# EAGLE board design_main (EAGLE 9.6.2), part 1 of 2
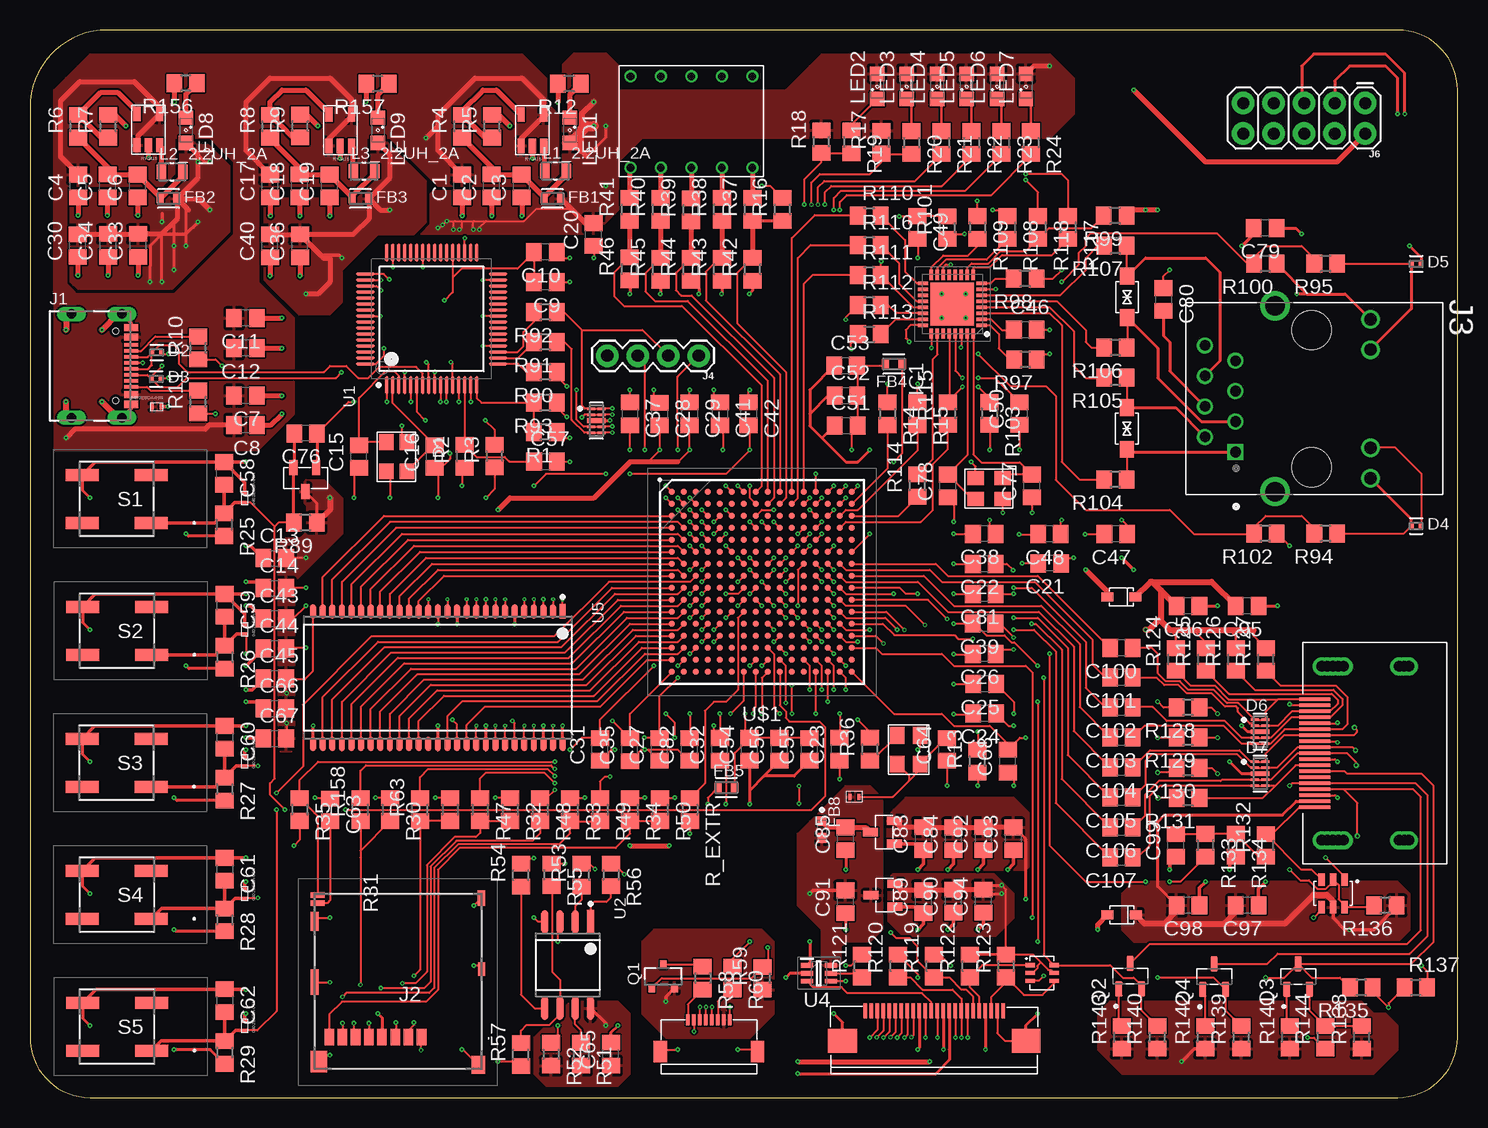
[diagram p4: board, top side]
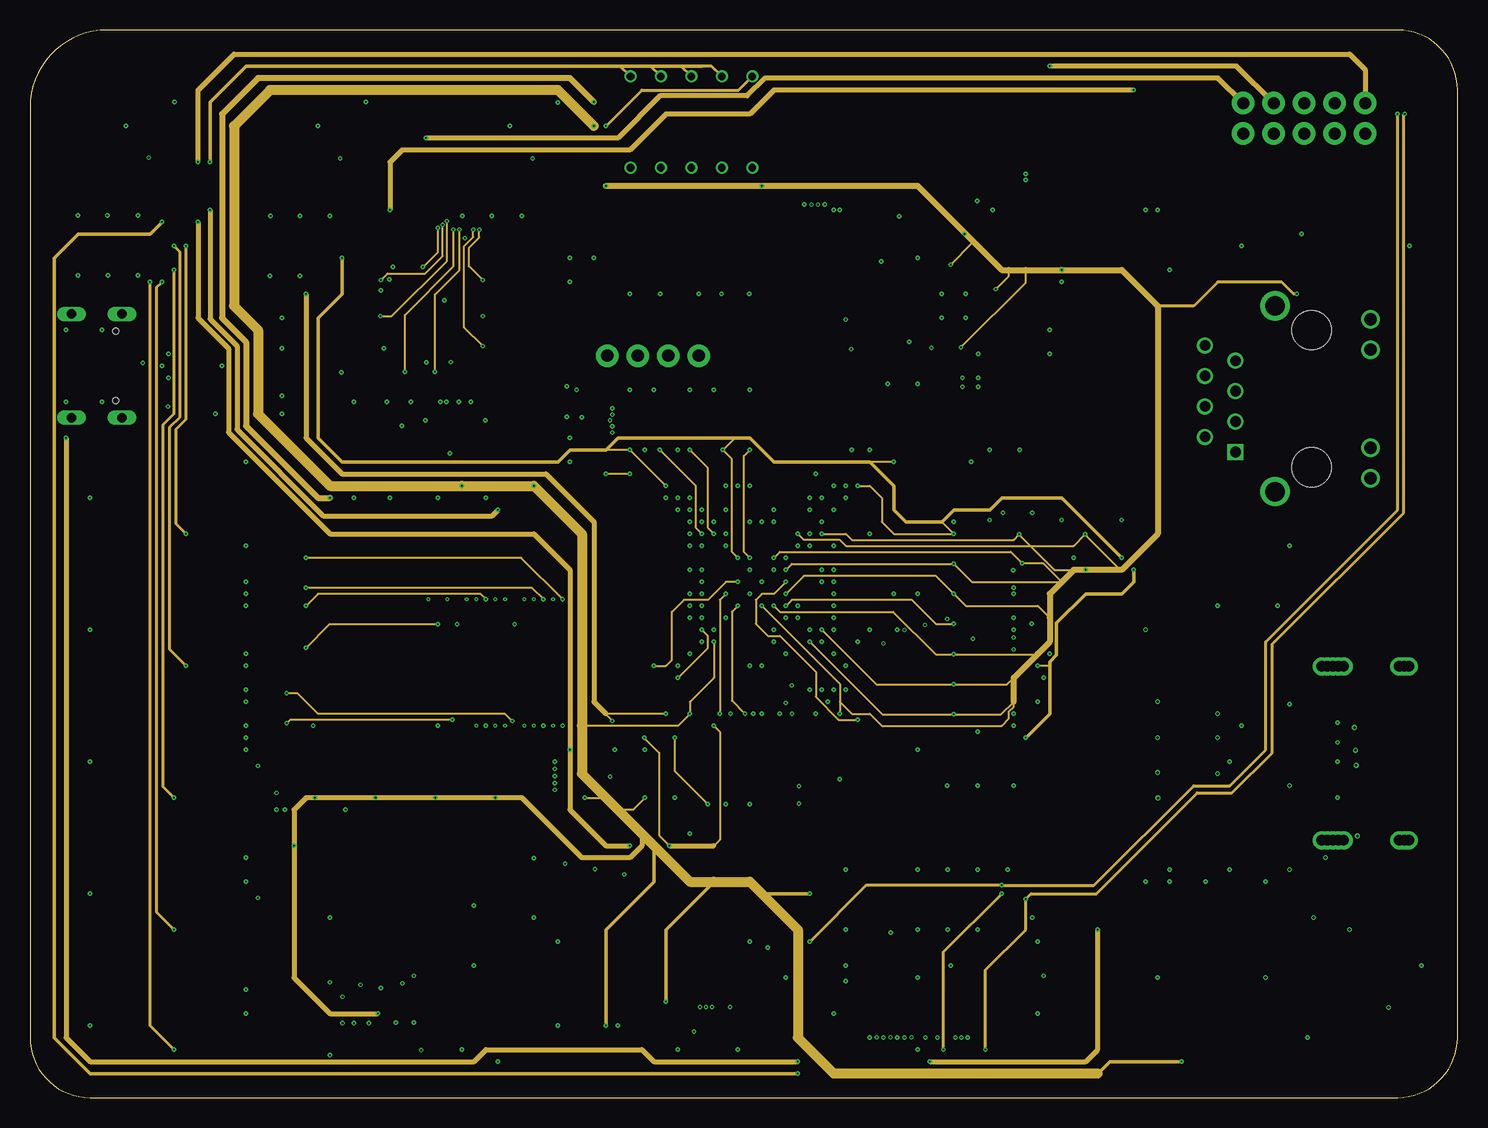
[diagram p5: board, inner layer Route2]
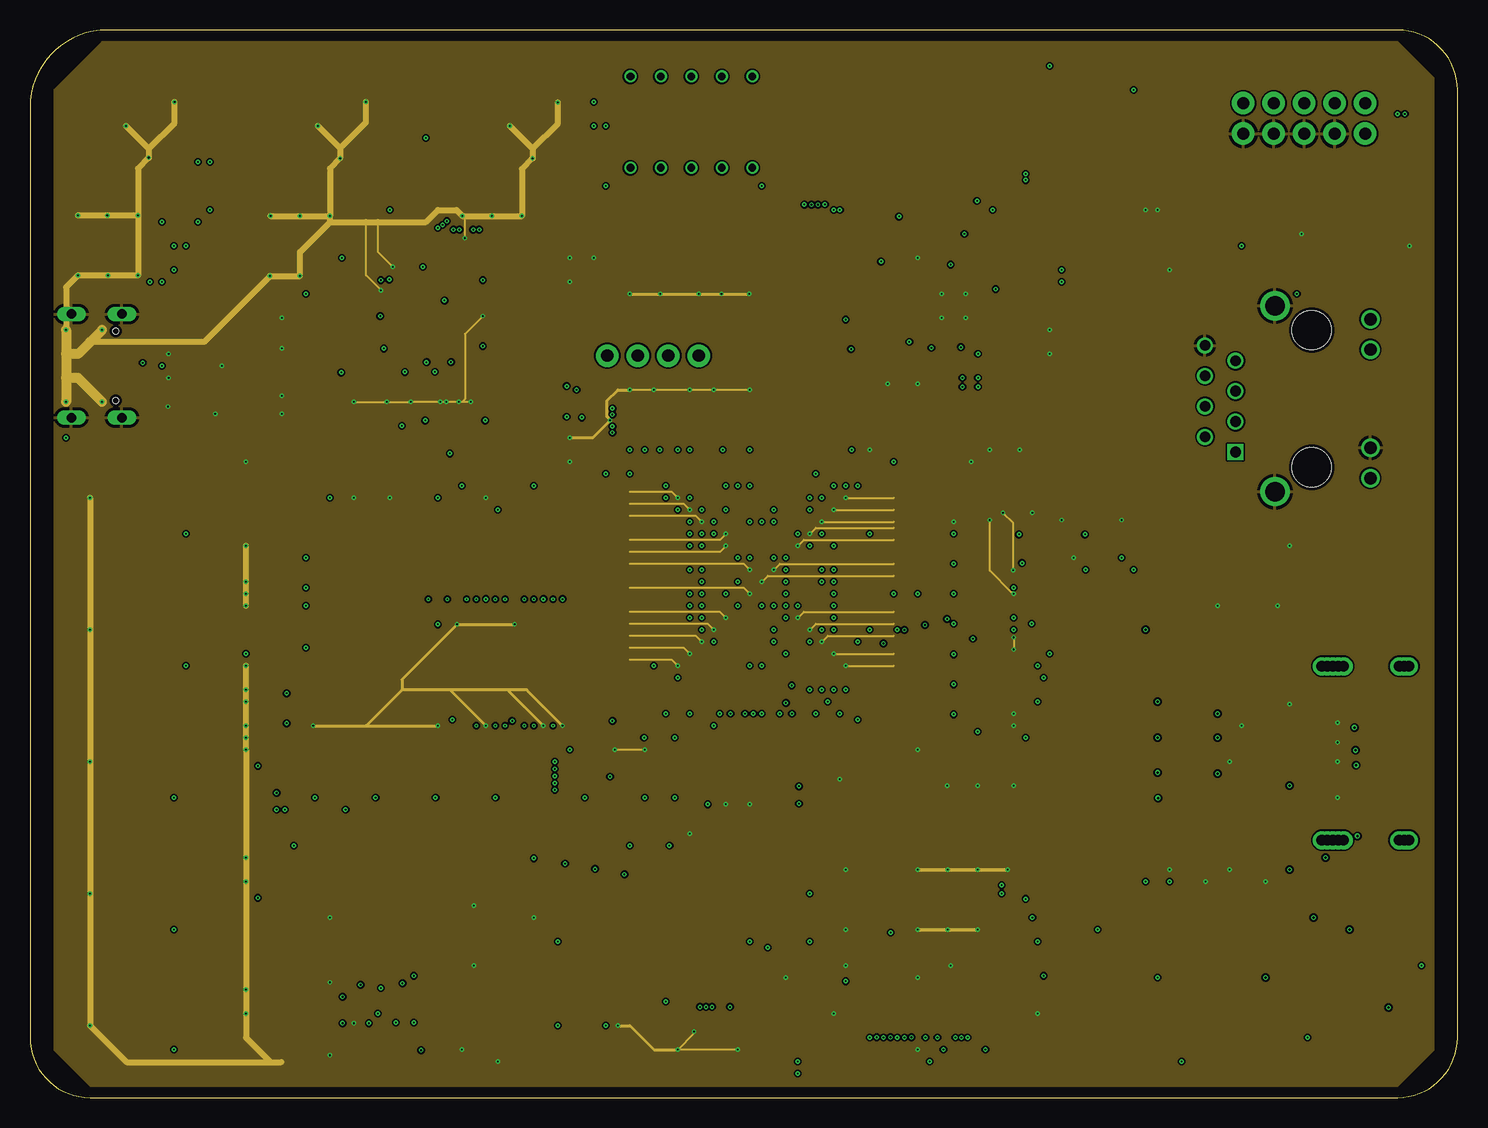
[diagram p6: board, inner layer Route15]
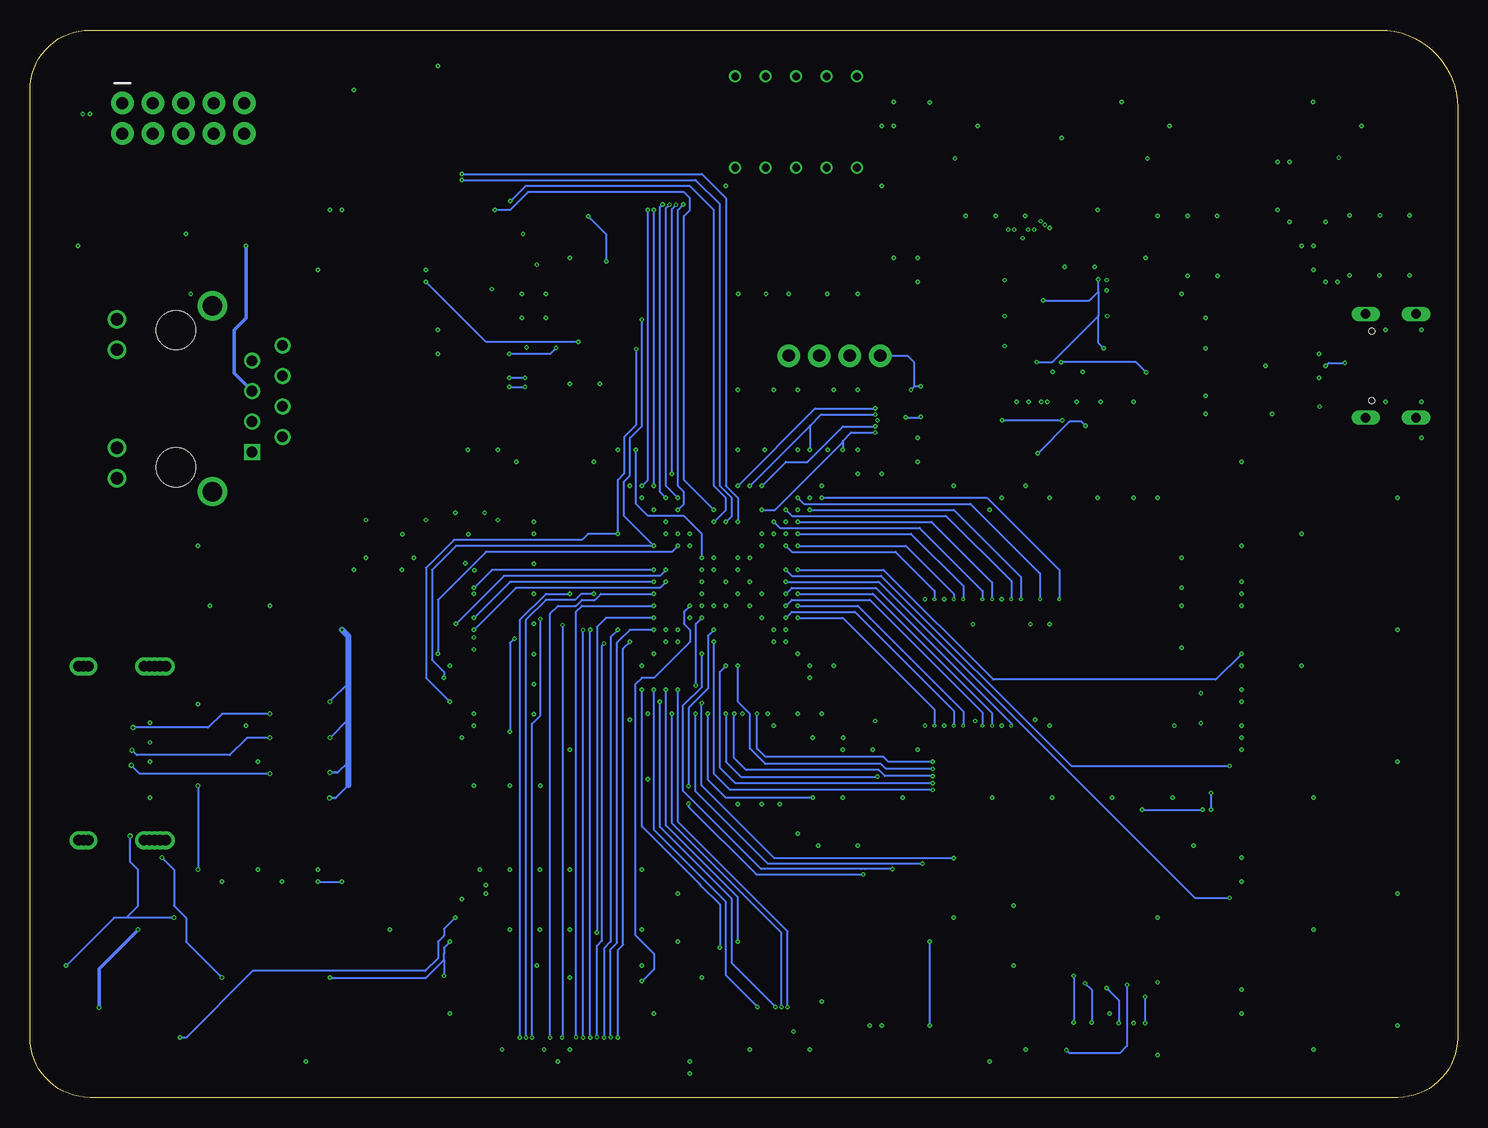
[diagram p7: board, bottom side, seen from below]

Size 119 x 89 mm. Coordinates in mm from the lower left corner, seen from the top.
Outline: 119,5 119,84 arc90 114,89 6.45,89 arc90 0,82.55 0,5 arc90 5,0 114,0 arc90 119,5
Copper layers [2:(1+(2*15)+16):15]: Top 0.035mm / dielectric 1.5mm / Route2 0.035mm / dielectric 0.15mm / Route15 0.035mm / dielectric 0.2mm / Bottom 0.035mm
Design rules "default *": minimum track width 0.1mm, minimum drill 0.1mm, track to track 6mil, track to pad 6mil, pad to pad 6mil, via to via 6mil, smd to smd 6mil, copper to edge 10mil, drill to drill 0.1mm, minimum pad ring 4mil, minimum via ring 4mil, stop-mask expansion 4mil, vias tented up to drill 0mil, thermal gap 10mil

## Footprints (pad centres in the part's own frame; a part is rotated, then mirrored left to right if it is on the bottom)
C0805 = smd 1.3 x 1.5: 1 -0.95,0; 2 0.95,0
SEMTECH_RCLAMP0524PATCT_0 = smd 0.675 x 0.2: 1 -0.438,1; 2 -0.438,0.5; 4 -0.438,-0.5; 5 -0.438,-1; 6 0.438,-1; 7 0.438,-0.5; 9 0.438,0.5; 10 0.438,1 | smd 1.55 x 0.4: 3-8 0,0
MURATA_LXES15AAA1-153_0 = smd 0.4 x 0.5: 1 -0.4,0; 2 0.4,0
UPZ1005D121-1R3TF = smd 0.25 x 0.5: P$1 0.375,0; P$2 -0.375,0
TDK_MPZ1608S101ATAH0_0 = smd 0.6 x 0.8: 1 -0.7,0; 2 0.7,0
TDK_MPZ1608S601ATD25_0 = smd 0.6 x 0.8: 1 -0.7,0; 2 0.7,0
SUNLORD_GZ1608D121TF_0 = smd 0.8 x 0.8: 1 -0.7,0; 2 0.7,0
QFN50P500X500X100-33N = smd 0.85 x 0.3: 1 -2.45,1.75; 2 -2.45,1.25; 3 -2.45,0.75; 4 -2.45,0.25; 5 -2.45,-0.25; 6 -2.45,-0.75; 7 -2.45,-1.25; 8 -2.45,-1.75; 17 2.45,-1.75; 18 2.45,-1.25; 19 2.45,-0.75; 20 2.45,-0.25; 21 2.45,0.25; 22 2.45,0.75; 23 2.45,1.25; 24 2.45,1.75 | smd 0.3 x 0.85: 9 -1.75,-2.45; 10 -1.25,-2.45; 11 -0.75,-2.45; 12 -0.25,-2.45; 13 0.25,-2.45; 14 0.75,-2.45; 15 1.25,-2.45; 16 1.75,-2.45; 25 1.75,2.45; 26 1.25,2.45; 27 0.75,2.45; 28 0.25,2.45; 29 -0.25,2.45; 30 -0.75,2.45; 31 -1.25,2.45; 32 -1.75,2.45 | smd 3.6 x 3.6: 33 0,0
C5178539_TYPE-C = drill 0.8 pad 1.067 long: 1 -4.32,2.65; 2 4.32,2.65; 3 -4.32,-1.55; 4 4.32,-1.55 | smd 0.6 x 1.15: A1-B12 -3.2,3.425; A4-B9 -2.4,3.425; B1-A12 3.2,3.425; B4-A9 2.4,3.425 | smd 0.3 x 1.15: A5 -1.25,3.425; A6 -0.25,3.425; A7 0.25,3.425; A8 1.25,3.425; B5 1.75,3.425; B6 0.75,3.425; B7 -0.75,3.425; B8 -1.75,3.425 | hole 0.5: -2.9,2.15; 2.9,2.15
22017781 = smd 0.8 x 1.4: 1 3.875,-4.65; 2 2.774,-4.65; 3 1.674,-4.65; 4 0.574,-4.65; 5 -0.526,-4.65; 6 -1.626,-4.65; 7 -2.726,-4.65; 8 -3.826,-4.65 | smd 1.15 x 0.45: 9 -4.791,7.175; 10 -4.791,6.515 | smd 1.35 x 1.8: 11 -4.69,-6.7 | smd 0.65 x 2.14: 12 -5.041,-0.07 | smd 0.65 x 1.6: 13 -5.041,5.01 | smd 0.65 x 1.3: 14 8.86,6.95 | smd 0.6 x 1.15: 15 8.885,1.025 | smd 1.16 x 1.5: 16 8.604,-6.95
HANRUN_HR911105A = drill 0.89 square: 1 4.45,-6.35 | drill 0.89: 2 3.18,-8.89; 3 1.91,-6.35; 4 0.64,-8.89; 5 -0.63,-6.35; 6 -1.9,-8.89; 7 -3.17,-6.35; 8 -4.44,-8.89 | drill 1.02: 9 6.625,4.9; 10 4.085,4.9; 11 -4.085,4.9; 12 -6.625,4.9 | drill 1.63: 15 7.745,-3.05; 16 -7.745,-3.05 | hole 3.25: -5.715,0; 5.715,0
1X04 = drill 1.016 pad 1.88: 1 0,0; 2 2.54,0; 3 5.08,0; 4 7.62,0
2X5 = drill 1.016 pad 1.88: 1 0,0; 2 0,2.54; 3 2.54,0; 4 2.54,2.54; 5 5.08,0; 6 5.08,2.54; 7 7.62,0; 8 7.62,2.54; 9 10.16,0; 10 10.16,2.54
TDK_MLZ2012N6R8LT000_0 = smd 0.8 x 1.2: 1 -0.9,0; 2 0.9,0
SML0805 = smd 1.2 x 1.2: A 1.05,0; C -1.05,0
VISHAY_SI2301CDS-T1-GE3_0 = smd 0.559 x 0.724: 1 -0.95,-0.984; 2 0.95,-0.984; 3 0,0.984
SOT95P240X111-3N = smd 1.23 x 0.6: 1 -1.06,0.95; 2 -1.06,-0.95; 3 1.06,0
R0805 = smd 1.3 x 1.5: 1 -0.95,0; 2 0.95,0
SKRAAME010 = smd 2.75 x 1: 1 -2.875,2; 2 2.875,2; 3 -2.875,-2; 4 2.875,-2
FTDI_FT2232HL-REEL_0 = smd 1.55 x 0.25: 1 -5.525,3.75; 2 -5.525,3.25; 3 -5.525,2.75; 4 -5.525,2.25; 5 -5.525,1.75; 6 -5.525,1.25; 7 -5.525,0.75; 8 -5.525,0.25; 9 -5.525,-0.25; 10 -5.525,-0.75; 11 -5.525,-1.25; 12 -5.525,-1.75; 13 -5.525,-2.25; 14 -5.525,-2.75; 15 -5.525,-3.25; 16 -5.525,-3.75; 33 5.525,-3.75; 34 5.525,-3.25; 35 5.525,-2.75; 36 5.525,-2.25; 37 5.525,-1.75; 38 5.525,-1.25; 39 5.525,-0.75; 40 5.525,-0.25; 41 5.525,0.25; 42 5.525,0.75; 43 5.525,1.25; 44 5.525,1.75; 45 5.525,2.25; 46 5.525,2.75; 47 5.525,3.25; 48 5.525,3.75 | smd 0.25 x 1.55: 17 -3.75,-5.525; 18 -3.25,-5.525; 19 -2.75,-5.525; 20 -2.25,-5.525; 21 -1.75,-5.525; 22 -1.25,-5.525; 23 -0.75,-5.525; 24 -0.25,-5.525; 25 0.25,-5.525; 26 0.75,-5.525; 27 1.25,-5.525; 28 1.75,-5.525; 29 2.25,-5.525; 30 2.75,-5.525; 31 3.25,-5.525; 32 3.75,-5.525; 49 3.75,5.525; 50 3.25,5.525; 51 2.75,5.525; 52 2.25,5.525; 53 1.75,5.525; 54 1.25,5.525; 55 0.75,5.525; 56 0.25,5.525; 57 -0.25,5.525; 58 -0.75,5.525; 59 -1.25,5.525; 60 -1.75,5.525; 61 -2.25,5.525; 62 -2.75,5.525; 63 -3.25,5.525; 64 -3.75,5.525
WINBOND_W25Q32JVSSIQ_0 = smd 2.005 x 0.598: 1 -3.6,1.905; 2 -3.6,0.635; 3 -3.6,-0.635; 4 -3.6,-1.905; 5 3.6,-1.905; 6 3.6,-0.635; 7 3.6,0.635; 8 3.6,1.905
SOT65P210X110-6N = smd 1 x 0.4: 1 -1,0.65; 2 -1,0; 3 -1,-0.65; 4 1,-0.65; 5 1,0; 6 1,0.65
MICRON_MT48LC16M16A2P-6A-G_0 = smd 1.206 x 0.486: 1 -5.53,10.4; 2 -5.53,9.6; 3 -5.53,8.8; 4 -5.53,8; 5 -5.53,7.2; 6 -5.53,6.4; 7 -5.53,5.6; 8 -5.53,4.8; 9 -5.53,4; 10 -5.53,3.2; 11 -5.53,2.4; 12 -5.53,1.6; 13 -5.53,0.8; 14 -5.53,0; 15 -5.53,-0.8; 16 -5.53,-1.6; 17 -5.53,-2.4; 18 -5.53,-3.2; 19 -5.53,-4; 20 -5.53,-4.8; 21 -5.53,-5.6; 22 -5.53,-6.4; 23 -5.53,-7.2; 24 -5.53,-8; 25 -5.53,-8.8; 26 -5.53,-9.6; 27 -5.53,-10.4; 28 5.53,-10.4; 29 5.53,-9.6; 30 5.53,-8.8; 31 5.53,-8; 32 5.53,-7.2; 33 5.53,-6.4; 34 5.53,-5.6; 35 5.53,-4.8; 36 5.53,-4; 37 5.53,-3.2; 38 5.53,-2.4; 39 5.53,-1.6; 40 5.53,-0.8; 41 5.53,0; 42 5.53,0.8; 43 5.53,1.6; 44 5.53,2.4; 45 5.53,3.2; 46 5.53,4; 47 5.53,4.8; 48 5.53,5.6; 49 5.53,6.4; 50 5.53,7.2; 51 5.53,8; 52 5.53,8.8; 53 5.53,9.6; 54 5.53,10.4
BGA256C100P16X16_1700X1700X155 = smd 0.45 x 0.45: A1 -7.5,7.5; A2 -6.5,7.5; A3 -5.5,7.5; A4 -4.5,7.5; A5 -3.5,7.5; A6 -2.5,7.5; A7 -1.5,7.5; A8 -0.5,7.5; A9 0.5,7.5; A10 1.5,7.5; A11 2.5,7.5; A12 3.5,7.5; A13 4.5,7.5; A14 5.5,7.5; A15 6.5,7.5; A16 7.5,7.5; B1 -7.5,6.5; B2 -6.5,6.5; B3 -5.5,6.5; B4 -4.5,6.5; B5 -3.5,6.5; B6 -2.5,6.5; B7 -1.5,6.5; B8 -0.5,6.5; B9 0.5,6.5; B10 1.5,6.5; B11 2.5,6.5; B12 3.5,6.5; B13 4.5,6.5; B14 5.5,6.5; B15 6.5,6.5; B16 7.5,6.5; C1 -7.5,5.5; C2 -6.5,5.5; C3 -5.5,5.5; C4 -4.5,5.5; C5 -3.5,5.5; C6 -2.5,5.5; C7 -1.5,5.5; C8 -0.5,5.5; C9 0.5,5.5; C10 1.5,5.5; C11 2.5,5.5; C12 3.5,5.5; C13 4.5,5.5; C14 5.5,5.5; C15 6.5,5.5; C16 7.5,5.5; D1 -7.5,4.5; D2 -6.5,4.5; D3 -5.5,4.5; D4 -4.5,4.5; D5 -3.5,4.5; D6 -2.5,4.5; D7 -1.5,4.5; D8 -0.5,4.5; D9 0.5,4.5; D10 1.5,4.5; D11 2.5,4.5; D12 3.5,4.5; D13 4.5,4.5; D14 5.5,4.5; D15 6.5,4.5; D16 7.5,4.5; E1 -7.5,3.5; E2 -6.5,3.5; E3 -5.5,3.5; E4 -4.5,3.5; E5 -3.5,3.5; E6 -2.5,3.5; E7 -1.5,3.5; E8 -0.5,3.5; E9 0.5,3.5; E10 1.5,3.5; E11 2.5,3.5; E12 3.5,3.5; E13 4.5,3.5; E14 5.5,3.5; E15 6.5,3.5; E16 7.5,3.5; F1 -7.5,2.5; F2 -6.5,2.5; F3 -5.5,2.5; F4 -4.5,2.5; F5 -3.5,2.5; F6 -2.5,2.5; F7 -1.5,2.5; F8 -0.5,2.5; F9 0.5,2.5; F10 1.5,2.5; F11 2.5,2.5; F12 3.5,2.5; F13 4.5,2.5; F14 5.5,2.5; F15 6.5,2.5; F16 7.5,2.5; G1 -7.5,1.5; G2 -6.5,1.5; G3 -5.5,1.5; G4 -4.5,1.5; G5 -3.5,1.5; G6 -2.5,1.5; G7 -1.5,1.5; G8 -0.5,1.5; G9 0.5,1.5; G10 1.5,1.5; G11 2.5,1.5; G12 3.5,1.5; G13 4.5,1.5; G14 5.5,1.5; G15 6.5,1.5; G16 7.5,1.5; H1 -7.5,0.5; H2 -6.5,0.5; H3 -5.5,0.5; H4 -4.5,0.5; H5 -3.5,0.5; H6 -2.5,0.5; H7 -1.5,0.5; H8 -0.5,0.5; H9 0.5,0.5; H10 1.5,0.5; H11 2.5,0.5; H12 3.5,0.5; H13 4.5,0.5; H14 5.5,0.5; H15 6.5,0.5; H16 7.5,0.5; J1 -7.5,-0.5; J2 -6.5,-0.5; J3 -5.5,-0.5; J4 -4.5,-0.5; J5 -3.5,-0.5; J6 -2.5,-0.5; J7 -1.5,-0.5; J8 -0.5,-0.5; J9 0.5,-0.5; J10 1.5,-0.5; J11 2.5,-0.5; J12 3.5,-0.5; J13 4.5,-0.5; J14 5.5,-0.5; J15 6.5,-0.5; J16 7.5,-0.5; K1 -7.5,-1.5; K2 -6.5,-1.5; K3 -5.5,-1.5; K4 -4.5,-1.5; K5 -3.5,-1.5; K6 -2.5,-1.5; K7 -1.5,-1.5; K8 -0.5,-1.5; K9 0.5,-1.5; K10 1.5,-1.5; K11 2.5,-1.5; K12 3.5,-1.5; K13 4.5,-1.5; K14 5.5,-1.5; K15 6.5,-1.5; K16 7.5,-1.5; L1 -7.5,-2.5; L2 -6.5,-2.5; L3 -5.5,-2.5; L4 -4.5,-2.5; L5 -3.5,-2.5; L6 -2.5,-2.5; L7 -1.5,-2.5; L8 -0.5,-2.5; L9 0.5,-2.5; L10 1.5,-2.5; L11 2.5,-2.5; L12 3.5,-2.5; L13 4.5,-2.5; L14 5.5,-2.5; L15 6.5,-2.5; L16 7.5,-2.5; M1 -7.5,-3.5; M2 -6.5,-3.5; M3 -5.5,-3.5; M4 -4.5,-3.5; M5 -3.5,-3.5; M6 -2.5,-3.5; M7 -1.5,-3.5; M8 -0.5,-3.5; M9 0.5,-3.5; M10 1.5,-3.5; M11 2.5,-3.5; M12 3.5,-3.5; M13 4.5,-3.5; M14 5.5,-3.5; M15 6.5,-3.5; M16 7.5,-3.5; N1 -7.5,-4.5; N2 -6.5,-4.5; N3 -5.5,-4.5; N4 -4.5,-4.5; N5 -3.5,-4.5; N6 -2.5,-4.5; N7 -1.5,-4.5; N8 -0.5,-4.5; N9 0.5,-4.5; N10 1.5,-4.5; N11 2.5,-4.5; N12 3.5,-4.5; N13 4.5,-4.5; N14 5.5,-4.5; N15 6.5,-4.5; N16 7.5,-4.5; P1 -7.5,-5.5; P2 -6.5,-5.5; P3 -5.5,-5.5; P4 -4.5,-5.5; P5 -3.5,-5.5; P6 -2.5,-5.5; P7 -1.5,-5.5; P8 -0.5,-5.5; P9 0.5,-5.5; P10 1.5,-5.5; P11 2.5,-5.5; P12 3.5,-5.5; P13 4.5,-5.5; P14 5.5,-5.5; P15 6.5,-5.5; P16 7.5,-5.5; R1 -7.5,-6.5; R2 -6.5,-6.5; R3 -5.5,-6.5; R4 -4.5,-6.5; R5 -3.5,-6.5; R6 -2.5,-6.5; R7 -1.5,-6.5; R8 -0.5,-6.5; R9 0.5,-6.5; R10 1.5,-6.5; R11 2.5,-6.5; R12 3.5,-6.5; R13 4.5,-6.5; R14 5.5,-6.5; R15 6.5,-6.5; R16 7.5,-6.5; T1 -7.5,-7.5; T2 -6.5,-7.5; T3 -5.5,-7.5; T4 -4.5,-7.5; T5 -3.5,-7.5; T6 -2.5,-7.5; T7 -1.5,-7.5; T8 -0.5,-7.5; T9 0.5,-7.5; T10 1.5,-7.5; T11 2.5,-7.5; T12 3.5,-7.5; T13 4.5,-7.5; T14 5.5,-7.5; T15 6.5,-7.5; T16 7.5,-7.5
XC32M4-12MHZ = smd 1.3 x 1.2: 1 -1.15,-0.85; 2 1.3,-0.85; 3 1.3,0.85; 4 -1.15,0.85
RY3415 = smd 0.6 x 1.2: 1 -0.95,-1.3; 2 0,-1.3; 3 0.95,-1.3; 4 0.95,1.3; 5 -0.95,1.3
0402ESDA-05N = smd 0.25 x 0.5: 1 0.375,0; 2 -0.375,0
DP-05RP = drill 0.65 pad 1: 1 -5.08,3.81; 2 -2.54,3.81; 3 0,3.81; 4 2.54,3.81; 5 5.08,3.81; 6 5.08,-3.81; 7 2.54,-3.81; 8 0,-3.81; 9 -2.54,-3.81; 10 -5.08,-3.81
0.5K-1.5-8PWB = smd 0.3 x 0.9: 1 -1.75,0; 2 -1.25,0; 3 -0.75,0; 4 -0.25,0; 5 0.25,0; 6 0.75,0; 7 1.25,0; 8 1.75,0 | smd 1.1 x 1.8: 9 4.05,-2.65; 10 -4.05,-2.65
Q33310F70060000-27MHZ = smd 1.4 x 1.2: 1 -1.2,-0.95; 2 1.2,-0.95; 3 1.2,0.95; 4 -1.2,0.95
SGM803-SXN3L-TR = smd 1.25 x 0.7: 1 0,-1.9; 2 0,0; 3 -2,-1
TAXM25M4RFBCCT2T-25MHZ = smd 1.4 x 1.2: 1 -1.125,-0.875; 2 1.125,-0.875; 3 1.125,0.875; 4 -1.125,0.875
SMF30CA = smd 1.4 x 1.2: 1 -1.73,0; 2 1.73,0
LN6206P302 = smd 1.25 x 0.7: 1 1,-0.95; 2 1,0.95; 3 -1,0
LN6206P282 = smd 1.25 x 0.7: 1 1,-0.95; 2 1,0.95; 3 -1,0
F-FPC0M24P-C310 = smd 0.3 x 1.25: 1 -5.75,-1.25; 2 -5.25,-1.25; 3 -4.75,-1.25; 4 -4.25,-1.25; 5 -3.75,-1.25; 6 -3.25,-1.25; 7 -2.75,-1.25; 8 -2.25,-1.25; 9 -1.75,-1.25; 10 -1.25,-1.25; 11 -0.75,-1.25; 12 -0.25,-1.25; 13 0.25,-1.25; 14 0.75,-1.25; 15 1.25,-1.25; 16 1.75,-1.25; 17 2.25,-1.25; 18 2.75,-1.25; 19 3.25,-1.25; 20 3.75,-1.25; 21 4.25,-1.25; 22 4.75,-1.25; 23 5.25,-1.25; 24 5.75,-1.25 | smd 2.4 x 2: 25 -7.65,1.26; 26 7.65,1.26
2N7002KD = smd 0.35 x 0.78: P$1 -0.65,-1; P$2 0,-1; P$3 0.65,-1; P$4 0.65,1; P$5 0,1; P$6 -0.65,1
1N5819WS = smd 1 x 0.75: 1 -1.173,0; 2 1.173,0
KH-HDMI-0005A-SMT = smd 0.3 x 2.6: 1 4.5,0; 2 4,0; 3 3.5,0; 4 3,0; 5 2.5,0; 6 2,0; 7 1.5,0; 8 1,0; 9 0.5,0; 10 0,0; 11 -0.5,0; 12 -1,0; 13 -1.5,0; 14 -2,0; 15 -2.5,0; 16 -3,0; 17 -3.5,0; 18 -4,0; 19 -4.5,0 | drill 0.9 pad 1.5: P$20 -7.25,-1.5; P$21 -7.25,-0.6; P$22 -7.25,-2.4; P$23 -7.25,-1.95; P$24 -7.25,-1.05; P$25 -7.25,-7.45; P$26 -7.25,-7.05; P$27 -7.25,-7.85; P$28 7.25,-1.5; P$29 7.25,-0.6; P$30 7.25,-2.4; P$31 7.25,-1.95; P$32 7.25,-1.05; P$33 7.25,-7.45; P$34 7.25,-7.05; P$35 7.25,-7.85
SRV05-4 = smd 0.532 x 1.072: 1 -0.95,-1.149; 2 0,-1.149; 3 0.95,-1.149; 4 0.95,1.149; 5 0,1.149; 6 -0.95,1.149

## Placement (x,y rotation side)
C1  10uF  [C0805]  36.02,75.99 90 top
C2  100nF  [C0805]  38.49,76 90 top
C3  10uF  [C0805]  40.97,75.99 90 top
C4  10uF  [C0805]  4.02,75.99 90 top
C5  100nF  [C0805]  6.49,76 90 top
C6  10uF  [C0805]  8.97,75.99 90 top
C7  22uF  [C0805]  17.96,58.52 180 top
C8  22uF  [C0805]  17.96,56.07 180 top
C9  1uF  [C0805]  42.96,67.97 180 top
C10  1uF  [C0805]  42.95,70.47 180 top
C11  22uF  [C0805]  17.96,64.97 180 top
C12  22uF  [C0805]  17.96,62.47 180 top
C13  100nF  [C0805]  20.4,44.96 0 top
C14  100nF  [C0805]  20.4,42.46 0 top
C15  22pF  [C0805]  27.42,53.44 90 top
C16  22pF  [C0805]  33.72,53.44 90 top
C17  10uF  [C0805]  20.02,75.99 90 top
C18  100nF  [C0805]  22.49,76 90 top
C19  10uF  [C0805]  24.97,75.99 90 top
C20  100nF  [C0805]  46.99,71.95 90 top
C21  100nF  [C0805]  85,44.54 180 top
C22  100nF  [C0805]  79.55,44.49 180 top
C23  100nF  [C0805]  67.49,29.05 90 top
C24  100nF  [C0805]  79.58,32.02 180 top
C25  100nF  [C0805]  79.58,34.47 180 top
C26  100nF  [C0805]  79.55,37 180 top
C27  100nF  [C0805]  52.47,29.02 90 top
C28  100nF  [C0805]  52.48,56.98 270 top
C29  100nF  [C0805]  54.97,57 270 top
C30  100nF  [C0805]  3.97,71.02 90 top
C31  100nF  [C0805]  47.52,29.02 90 top
C32  100nF  [C0805]  57.5,29.03 90 top
C33  10uF  [C0805]  9.02,71.04 90 top
C34  10uF  [C0805]  6.52,71.04 90 top
C35  100nF  [C0805]  50,29 90 top
C36  100nF  [C0805]  22.5,71 90 top
C37  100nF  [C0805]  50,57 270 top
C38  100nF  [C0805]  79.55,47 180 top
C39  100nF  [C0805]  79.53,39.51 180 top
C40  100nF  [C0805]  20,71 90 top
C41  4.7uF  [C0805]  57.5,57 270 top
C42  100nF  [C0805]  59.9,57 270 top
C43  100nF  [C0805]  20.4,39.95 0 top
C44  100nF  [C0805]  20.4,37.45 0 top
C45  100nF  [C0805]  20.4,34.95 0 top
C46  100nF  [C0805]  82.97,64.03 0 top
C47  10uF  [C0805]  90.51,46.97 180 top
C48  100nF  [C0805]  84.98,46.97 180 top
C49  1nF  [C0805]  73.98,72.53 270 top
C50  100nF  [C0805]  82.47,57.02 90 top
C51  10uF  [C0805]  68.04,56.03 0 top
C52  100nF  [C0805]  68.02,58.53 0 top
C53  10nF  [C0805]  67.99,61.03 0 top
C54  10uF  [C0805]  59.99,29.03 90 top
C55  100nF  [C0805]  64.98,29.02 90 top
C56  10nF  [C0805]  62.49,29.03 90 top
C57  100nF  [C0805]  42.97,53.03 0 top
C58  100nF  [C0805]  16.18,52.03 270 top
C59  100nF  [C0805]  16.23,41.03 270 top
C60  100nF  [C0805]  16.23,30.03 270 top
C61  100nF  [C0805]  16.23,19.03 270 top
C62  100nF  [C0805]  16.23,8.08 270 top
C63  2.2uF  [C0805]  25.03,23.98 270 top
C64  100nF  [C0805]  76.42,29.02 90 top
C65  100nF  [C0805]  48.42,3.62 90 top
C66  100nF  [C0805]  20.4,32.45 0 top
C67  100nF  [C0805]  20.4,29.95 0 top
C68  100nF  [C0805]  81.5,28.05 90 top
C76  100nF  [C0805]  22.98,55.37 180 top
C77  18pF  [C0805]  83.52,50.99 90 top
C78  18pF  [C0805]  76.52,50.99 90 top
C79  1nF  [C0805]  102.95,72.47 180 top
C80  1nF  [C0805]  94.48,66.53 270 top
C81  100nF  [C0805]  79.55,42 180 top
C82  100nF  [C0805]  54.97,29.02 90 top
C83  22uF  [C0805]  74.47,21.59 90 top
C84  100nF  [C0805]  76.97,21.57 90 top
C85  100nF  [C0805]  67.97,21.57 90 top
C89  10uF  [C0805]  74.47,16.34 90 top
C90  100nF  [C0805]  76.97,16.37 90 top
C91  100nF  [C0805]  67.97,16.32 90 top
C92  22uF  [C0805]  79.47,21.59 90 top
C93  100nF  [C0805]  81.97,21.57 90 top
C94  100nF  [C0805]  79.47,16.37 90 top
C95  10uF  [C0805]  101.46,40.97 180 top
C96  100nF  [C0805]  96.53,40.97 180 top
C97  10uF  [C0805]  101.46,16.02 180 top
C98  100nF  [C0805]  96.53,16.02 180 top
C99  2.2uF  [C0805]  95.52,21.02 90 top
C100  100nF  [C0805]  90.98,37.47 180 top
C101  100nF  [C0805]  90.98,35.02 180 top
C102  100nF  [C0805]  90.98,32.52 180 top
C103  100nF  [C0805]  90.98,30.02 180 top
C104  100nF  [C0805]  90.98,27.52 180 top
C105  100nF  [C0805]  90.98,25.02 180 top
C106  100nF  [C0805]  90.98,22.52 180 top
C107  100nF  [C0805]  90.98,20.02 180 top
D1  SEMTECH_RCLAMP0524PATCTSEMTECH_RCLAMP0524PATCT_0_0  [SEMTECH_RCLAMP0524PATCT_0]  47.22,56.43 0 top
D2  MURATA_LXES15AAA1-153MURATA_LXES15AAA1-153_0_0  [MURATA_LXES15AAA1-153_0]  10.56,62.11 0 top
D3  MURATA_LXES15AAA1-153MURATA_LXES15AAA1-153_0_0  [MURATA_LXES15AAA1-153_0]  10.53,59.91 0 top
D4  MURATA_LXES15AAA1-153MURATA_LXES15AAA1-153_0_0  [MURATA_LXES15AAA1-153_0]  115.55,47.65 0 top
D5  MURATA_LXES15AAA1-153MURATA_LXES15AAA1-153_0_0  [MURATA_LXES15AAA1-153_0]  115.55,69.5 0 top
D6  SEMTECH_RCLAMP0524PATCTSEMTECH_RCLAMP0524PATCT_0_0  [SEMTECH_RCLAMP0524PATCT_0]  102.55,30.5 0 top
D7  SEMTECH_RCLAMP0524PATCTSEMTECH_RCLAMP0524PATCT_0_0  [SEMTECH_RCLAMP0524PATCT_0]  102.55,27 0 top
FB  UPZ1005D121-1R3TF  [UPZ1005D121-1R3TF]  68.71,25.08 180 top
FB1  TDK_MPZ1608S101ATAH0TDK_MPZ1608S101ATAH0_0_0  [TDK_MPZ1608S101ATAH0_0]  43.55,74.95 0 top
FB2  TDK_MPZ1608S101ATAH0TDK_MPZ1608S101ATAH0_0_0  [TDK_MPZ1608S101ATAH0_0]  11.55,74.95 0 top
FB3  TDK_MPZ1608S101ATAH0TDK_MPZ1608S101ATAH0_0_0  [TDK_MPZ1608S101ATAH0_0]  27.55,74.95 0 top
FB4  TDK_MPZ1608S601ATD25TDK_MPZ1608S601ATD25_0_0  [TDK_MPZ1608S601ATD25_0]  72,61.15 180 top
FB5  TDK_MPZ1608S601ATD25TDK_MPZ1608S601ATD25_0_0  [TDK_MPZ1608S601ATD25_0]  58.05,25.85 0 top
FB8  SUNLORD_GZ1608D121TFSUNLORD_GZ1608D121TF_0_0  [SUNLORD_GZ1608D121TF_0]  66.01,22.35 270 top
IC1  RTL8201F-VB-CG  [QFN50P500X500X100-33N]  76.88,66.14 180 top
J1  C5178539_TYPE-CMOLEX_217179-0001_0_0  [C5178539_TYPE-C]  5,61 270 top
J2  2201778-1  [22017781]  28.77,9.69 0 top
J3  HR911105A  [HANRUN_HR911105A]  106.84,58.26 270 top
J4  [1X04]  55.75,61.85 180 top
J6  [2X5]  111.3,82.9 180 top
L1_2.2UH_2A  [TDK_MLZ2012N6R8LT000_0]  43.8,77.25 0 top
L2_2.2UH_2A  2.2uH 2A  [TDK_MLZ2012N6R8LT000_0]  11.85,77.18 0 top
L3_2.2UH_2A  2.2uH 2A  [TDK_MLZ2012N6R8LT000_0]  27.85,77.23 0 top
LED1  [SML0805]  45.01,80.64 270 top
LED2  Blue  [SML0805]  70.62,84.3 90 top
LED3  Blue  [SML0805]  73.07,84.3 90 top
LED4  Blue  [SML0805]  75.62,84.3 90 top
LED5  Blue  [SML0805]  78.07,84.3 90 top
LED6  Blue  [SML0805]  80.62,84.3 90 top
LED7  Blue  [SML0805]  83.02,84.29 90 top
LED8  [SML0805]  13.01,80.64 270 top
LED9  [SML0805]  29.01,80.64 270 top
Q1  VISHAY_SI2301CDS-T1-GE3VISHAY_SI2301CDS-T1-GE3_0_0  [VISHAY_SI2301CDS-T1-GE3_0]  52.78,10.11 0 top
Q2  2N7002  [SOT95P240X111-3N]  91.71,10.11 90 top
Q3  2N7002  [SOT95P240X111-3N]  105.71,10.09 90 top
Q4  2N7002  [SOT95P240X111-3N]  98.71,10.07 90 top
R1  1k  [R0805]  42.96,55.47 180 top
R2  10k  [R0805]  36.22,53.46 90 top
R3  12k  [R0805]  38.72,53.48 90 top
R4  680k  [R0805]  36.02,80.97 90 top
R5  150k  [R0805]  38.52,80.97 90 top
R6  150k  [R0805]  4.02,80.97 90 top
R7  100k  [R0805]  6.52,80.97 90 top
R8  100k  [R0805]  20.02,80.97 90 top
R9  150k  [R0805]  22.52,80.99 90 top
R10  5.1k  [R0805]  14.02,62.49 90 top
R11  5.1k  [R0805]  14.02,57.99 90 top
R12  220  [R0805]  44.96,84.52 180 top
R13  4.7k  [R0805]  78.97,28.04 90 top
R14  4.7k  [R0805]  71.48,57.01 270 top
R15  4.7k  [R0805]  73.98,57.01 270 top
R16  4.7k  [R0805]  62.72,74.04 90 top
R17  4.7k  [R0805]  70.97,79.64 90 top
R18  4.7k  [R0805]  65.97,79.69 90 top
R19  510  [R0805]  68.48,79.66 270 top
R20  510  [R0805]  73.48,79.61 270 top
R21  510  [R0805]  75.98,79.61 270 top
R22  510  [R0805]  78.48,79.61 270 top
R23  510  [R0805]  80.98,79.61 270 top
R24  510  [R0805]  83.43,79.61 270 top
R25  10k  [R0805]  16.18,47.76 270 top
R26  10k  [R0805]  16.23,36.71 270 top
R27  10k  [R0805]  16.23,25.71 270 top
R28  10k  [R0805]  16.23,14.81 270 top
R29  10k  [R0805]  16.23,3.76 270 top
R30  10k  [R0805]  30.03,24.01 270 top
R31  10k  [R0805]  35.03,24.01 270 top
R32  10k  [R0805]  40.03,24.01 270 top
R33  10k  [R0805]  45.03,24.01 270 top
R34  10k  [R0805]  50.03,24.01 270 top
R35  4.7k  [R0805]  22.48,24.01 270 top
R36  22  [R0805]  70.02,29.04 90 top
R37  165  [R0805]  60.22,74.04 90 top
R38  1.5k  [R0805]  57.67,74.04 90 top
R39  1.5k  [R0805]  55.1,74 90 top
R40  1.5k  [R0805]  52.57,74.04 90 top
R41  1.5k  [R0805]  49.97,74.04 90 top
R42  510  [R0805]  60.22,69.04 90 top
R43  13k  [R0805]  57.67,69.04 90 top
R44  13k  [R0805]  55.1,69.05 90 top
R45  13k  [R0805]  52.57,69.04 90 top
R46  13k  [R0805]  49.97,69.09 90 top
R47  33  [R0805]  37.53,24.01 270 top
R48  33  [R0805]  42.53,24.01 270 top
R49  33  [R0805]  47.53,24.01 270 top
R50  33  [R0805]  52.53,24.01 270 top
R51  4.7k  [R0805]  45.93,3.61 270 top
R52  4.7k  [R0805]  43.43,3.61 270 top
R53  33  [R0805]  45.97,18.54 90 top
R54  33  [R0805]  40.92,18.54 90 top
R55  33  [R0805]  43.48,18.56 270 top
R56  33  [R0805]  48.43,18.56 270 top
R57  1k  [R0805]  40.92,3.59 90 top
R58  10  [R0805]  56.08,9.96 270 top
R59  4.7k  [R0805]  61.07,9.94 90 top
R60  22  [R0805]  58.58,9.96 270 top
R63  33  [R0805]  32.5,24 90 top
R89  150k  [R0805]  22.96,47.92 180 top
R90  33  [R0805]  42.96,60.47 180 top
R91  33  [R0805]  42.96,62.97 180 top
R92  33  [R0805]  42.96,65.47 180 top
R93  33  [R0805]  42.96,57.92 180 top
R94  510  [R0805]  108.01,47.02 180 top
R95  510  [R0805]  108.01,69.52 180 top
R97  2.49k  [R0805]  82.98,61.52 180 top
R98  5.1k  [R0805]  82.96,68.27 180 top
R99  5.1k  [R0805]  90.46,73.52 180 top
R100  5.1k  [R0805]  102.98,69.52 180 top
R101  5.1k  [R0805]  76.47,72.52 90 top
R102  5.1k  [R0805]  102.98,47.02 180 top
R103  5.1k  [R0805]  79.98,57.03 270 top
R104  22  [R0805]  90.48,51.52 180 top
R105  22  [R0805]  90.48,60.02 180 top
R106  22  [R0805]  90.48,62.52 180 top
R107  22  [R0805]  90.48,71.02 180 top
R108  22  [R0805]  81.48,72.53 270 top
R109  22  [R0805]  78.98,72.53 270 top
R110  22  [R0805]  69.97,73.53 0 top
R111  22  [R0805]  69.97,68.58 0 top
R112  22  [R0805]  69.97,66.08 0 top
R113  22  [R0805]  69.97,63.63 0 top
R114  22  [R0805]  73.97,51.02 90 top
R115  22  [R0805]  76.52,57.02 90 top
R116  22  [R0805]  69.97,71.08 0 top
R117  22  [R0805]  86.53,72.53 270 top
R118  22  [R0805]  84.03,72.53 270 top
R119  56k  [R0805]  75.37,10.97 90 top
R120  56k  [R0805]  72.37,10.97 90 top
R121  10k  [R0805]  69.37,10.97 90 top
R122  5.1k  [R0805]  78.37,10.97 90 top
R123  5.1k  [R0805]  81.37,10.97 90 top
R124  49.9  [R0805]  95.52,36.52 90 top
R125  49.9  [R0805]  98.02,36.52 90 top
R126  49.9  [R0805]  100.52,36.52 90 top
R127  49.9  [R0805]  103.02,36.52 90 top
R128  49.9  [R0805]  96.53,32.52 180 top
R129  49.9  [R0805]  96.53,30.02 180 top
R130  49.9  [R0805]  96.53,27.47 180 top
R131  49.9  [R0805]  96.53,24.97 180 top
R132  5.1k  [R0805]  103.02,21.02 90 top
R133  22  [R0805]  97.98,21.03 270 top
R134  10k  [R0805]  100.53,21.03 270 top
R135  27k  [R0805]  110.98,9.17 180 top
R136  1.5k  [R0805]  112.98,16.02 180 top
R137  1.5k  [R0805]  115.52,9.18 0 top
R138  5.1k  [R0805]  111.02,5.02 90 top
R139  1.5k  [R0805]  100.97,5.02 90 top
R140  1.5k  [R0805]  93.97,5.02 90 top
R141  1.5k  [R0805]  105.02,5.02 90 top
R142  1.5k  [R0805]  97.97,5.02 90 top
R143  1.5k  [R0805]  91.02,5.02 90 top
R144  1.5k  [R0805]  107.97,5.02 90 top
R156  220  [R0805]  12.98,84.57 180 top
R157  220  [R0805]  28.98,84.52 180 top
R158  33  [R0805]  27.55,24 90 top
R_EXTR  10k  [R0805]  55.01,24 270 top
S1  SKRAAME010  [SKRAAME010]  7.23,49.91 180 top
S2  SKRAAME010  [SKRAAME010]  7.25,38.91 180 top
S3  SKRAAME010  [SKRAAME010]  7.22,27.91 180 top
S4  SKRAAME010  [SKRAAME010]  7.24,16.91 180 top
S5  SKRAAME010  [SKRAAME010]  7.26,5.91 180 top
U1  FTDI_FT2232HL-REELFTDI_FT2232HL-REEL_0_0  [FTDI_FT2232HL-REEL_0]  33.48,64.91 90 top
U2  WINBOND_W25Q32JVSSIQWINBOND_W25Q32JVSSIQ_0_0  [WINBOND_W25Q32JVSSIQ_0]  44.82,11.05 270 top
U4  74LVC1T45DW-7  [SOT65P210X110-6N]  65.75,10.36 0 top
U5  MICRON_MT48LC16M16A2P-6A-GMICRON_MT48LC16M16A2P-6A-G_0_0  [MICRON_MT48LC16M16A2P-6A-G_0]  34,35 270 top
U$1  GW2A-LV18PG256C8I7  [BGA256C100P16X16_1700X1700X155]  61,43 0 top
U$2  XC32M4-12MHZ  [XC32M4-12MHZ]  30.55,53.35 90 top
U$3  RY3415  [RY3415]  41.88,80.65 0 top
U$4  RY3415  [RY3415]  9.87,80.7 0 top
U$5  RY3415  [RY3415]  25.86,80.65 0 top
U$6  0402ESDA-05N  [0402ESDA-05N]  10.56,57.59 180 top
U$7  0402ESDA-05N  [0402ESDA-05N]  17.89,49.98 90 top
U$8  0402ESDA-05N  [0402ESDA-05N]  17.89,39.02 90 top
U$9  0402ESDA-05N  [0402ESDA-05N]  17.89,28.01 90 top
U$10  0402ESDA-05N  [0402ESDA-05N]  17.89,17 90 top
U$11  0402ESDA-05N  [0402ESDA-05N]  17.89,5.99 90 top
U$13  DP-05RP  [DP-05RP]  55.13,81.32 180 top
U$14  0.5K-1.5-8PWB  [0.5K-1.5-8PWB]  56.59,6.47 0 top
U$15  Q33310F70060000-27MHZ  [Q33310F70060000-27MHZ]  73.25,29 90 top
U$16  SGM803-SXN3L-TR  [SGM803-SXN3L-TR]  21.95,52.51 90 top
U$17  TAXM25M4RFBCCT2T-25MHZ  [TAXM25M4RFBCCT2T-25MHZ]  79.95,50.77 180 top
U$18  SMF30CA  [SMF30CA]  91.46,66.74 270 top
U$19  SMF30CA  [SMF30CA]  91.44,55.78 90 top
U$20  LN6206P302  [LN6206P302]  71.08,22.11 0 top
U$22  LN6206P282  [LN6206P282]  71.11,16.86 0 top
U$23  F-FPC0M24P-C310  [F-FPC0M24P-C310]  75.39,5.99 180 top
U$24  2N7002KD  [2N7002KD]  84.36,10.39 270 top
U$25  1N5819WS  [1N5819WS]  90.99,41.73 180 top
U$26  1N5819WS  [1N5819WS]  91,15.23 180 top
U$27  KH-HDMI-0005A-SMT  [KH-HDMI-0005A-SMT]  107.1,28.7 90 top
U$28  SRV05-4  [SRV05-4]  108.63,17.02 180 top

## Tracks (layer width: path | path; a pad name or v marks a point on that pad's centre or on a via)
1V0  (via drill 0.15 pad 0.25)
  Top 0.152: U$1.K10 v63,41 | v77,39.5 v77.01,39.51 C39.2 78.76,39.51 79.74,38.53 81.25,38.53 81.83,37.95 82.06,37.95 v84,36 | U$1.A1 v53,51 | v50,54 C37.2 | U$1.A16 v69,51 | U$1.G7 v59,45 | C41.2 57.75,55.8 v57.75,54 | v77,47 C38.2 | U$1.T16 72,32 76,32 77,31 80,31 81.5,29.5 C68.2 82.5,30 v83,30 | U$1.T1 50,32 C35.2 v48.55,31.4 v48.55,31.41 | FB5.1 56.5,25 v56.5,24.45 | v53.75,30 53.75,31.25 v53,32 | FB4.1 72.7,53.7 v72,53
  Top 0.305: 24.23,70.23 25.77,70.23 v26,70 | v91,45 v92,44
  Top 0.406: FB3.2 30,76.7 30,78.6 LED9.A | FB3.2 28.25,73.25 26.95,71.95 C36.2 | C40.2 C36.2 | FB3.2 29.2,74 v30,74 | C36.2 23.39,71.06 23.4,71.06 24.23,70.23 24.45,70 25,70 25,68 24,67 v23,67 | J6.2 108.94,78 98,78 v92,84
  Route2 0.152: v63,41 63.5,41.5 73.5,41.5 75.5,39.5 v77,39.5 | v53,51 v50,54 48,54 | v59,45 58.5,45.5 58.5,53.25 v57.75,54 58.75,55 59,55 | v69,51 70,51 71,50 71,48 72,47 v77,47 76,48 | v56.5,24.45 53.75,27.2 v53.75,30 | v53,32 48,32 48,31.95 v48.55,31.41 | 85,36 v84,36 | v72,53 70,53
  Route2 0.305: v26,70 26,67 24,65 24,55 26,53 44,53 45,54 48,54 49,55 59,55 60,55 62,53 70,53 72,51 72,49 73,48 76,48 77,49 80,49 81,50 86,50 v91,45 | v92,44 92,43 91,42 88,42 85.56,39.56 85.56,36.88 85,36.32 85,36 85,32 v83,30
  Route2 0.406: v23,67 23,55 26,52 43,52 47,48 47,33 48,32 | v92,84 62,84 60,82 53,82 50,79 31,79 30,78 v30,74
  pour Top: 19.5,75 19.5,68.2 19.95,67.75 22.4,65.3 25,65.3 26,66.3 26,67 26,69 28,71 29,72 29.6,72 32,72 33,73 33,76.4 30.15,79.25 29.8,79.6 28.45,79.6 28.45,76.4 27,74.95 19.55,74.95
1V5  (via drill 0.15 pad 0.25)
  Top 0.152: U$1.M4 v56,39 | 52.5,30 C27.2 | U$1.J7 59,42 v58,42 | v57.5,32 C32.2 57,30.48 v57,31 | U$1.E4 v56,47 | C28.2 52.5,56.01 v52.5,54 51.5,53 51,53 | U$1.D5 v57,47 | C29.2 54.98,54.02 v55,54 54,53 | U$1.H7 v59,43 | 47.5,29.99 C31.2 | C31.2 45.97,29.97 v45,29 | C27.2 52.45,29.95 | C31.2 47.52,31.52 v52,36 | C27.2 52.47,33.47 v54,35 | C27.2 52.44,30 v51.2,30 | 76.64,3.17 76.66,3.16
  Top 0.254: U$23.10 76.64,4.02 76.64,3.17 | R29.2 15.04,4 v12,4 | v10,68 10,69.28 10.05,69.32 10.05,71.05 10.99,71.99 v10.99,68.01 v11,68 | R28.2 12.14,13.86 v12,14 | R27.2 12.24,24.76 v12,25 | v12,69 v12,71 12,73 | R26.2 13.24,35.76 v13,36 | R25.2 13.19,46.81 v13,47 | v13,71 13,74 13.1,74.1 | v64,2 75.5,2 76.66,3.16
  Top 0.305: LED8.A 14.6,78 v15,78 | 11,73.7 v11,73 | C33.2 12.99,71.99 v14,73
  Top 0.406: FB2.2 14,76.7 v14,78 14,78.6 LED8.A | FB2.2 12.25,73.25 12,73 10.99,71.99 C33.2 C34.2 3.99,71.99 C30.2 | FB2.2 13.1,74.1 13.2,74 | v50,21 v53.3,21 | FB2.2 14.05,74.95 v15,74 | v39,49 40,50 47,50 50,53 51,53 54,53
  Route2 0.152: v56,39 56.5,38.5 56.5,37.5 v54,35 | v58,42 57.5,41.5 v57.5,32 | v56,47 55.5,47.5 55.5,51 v52.5,54 | v57,47 56.5,47.5 56.5,52.5 v55,54 | v59,43 58,43 56.5,41.5 54.5,41.5 53.5,40.5 53.5,36.5 53,36 v52,36 | 57,21 57.5,21.5 57.5,30.5 v57,31 | v53.3,21 52.45,21.85 52.45,28.75 v51.2,30
  Route2 0.254: U$13.6 49.18,86 49,86 | U$13.7 51.72,86 51,86 | U$13.8 54.26,86 54,86 | U$13.9 56.8,86 56,86 | v10,68 10,6 v12,4 | v12,14 10.55,15.45 10.55,60.8 10.54,60.81 10.54,67.54 v11,68 | v12,25 11.1,25.9 11.1,56.1 12.01,57.01 12.01,62.19 12,62.2 v12,69 | v13,36 11.65,37.35 11.65,55.9 12.5,56.75 12.5,70.5 v12,71 | v13,47 12.2,47.8 12.2,55.75 13,56.55 v13,71
  Route2 0.305: v15,78 15,83 18,86 49,86 51,86 54,86 56,86 | v11,73 10,72 4,72 2,70 2,5 5,2 v64,2
  Route2 0.406: v50,21 48,21 45,24 v45,29 45,44 42,47 25,47 16.55,55.45 16.55,62.45 14,65 v14,73 | v53.3,21 57,21 | v39,49 38.5,48.5 24.45,48.5 17.25,55.7 17.25,62.65 15,64.9 v15,74 | v14,78 14,84 17,87 110,87 111.3,85.7 J6.1
  pour Top: 13.7,79.65 13.9,79.45 14.85,79.45 16.6,77.7 16.6,72.15 11.85,67.4 4,67.4 3.4,68 3.4,75.15 3.7,75.45 11.4,75.45 12.5,76.55 12.5,79.65
2V8  (via drill 0.15 pad 0.25)
  Top 0.152: U$24.P$5 85.11,10.64 84.88,10.64 84.26,11.26 | 84.26,11.26 83.59,11.92 R123.2 81.37,17.33 v81,17.7 | 84.26,11.26 83.98,10.98 83.98,10.77 83.6,10.39 U$24.P$2
  Top 0.203: R122.2 R123.2
  Top 0.254: U$23.11 v76.14,4.01 v76.15,4 | v81,17 79.79,17 C94.2 79.85,17.7 v81,17.7 | v65,13 65,11.26 U4.1 | v114,82 114,85 113,86 110,86 108.76,84.76 J6.3
  Top 0.406: C94.2 C90.2 74.5,17.32 | C89.2 72.63,17.29 U$22.2
  Top 0.61: C89.2 74.5,17.32
  Route2 0.254: v76.15,4 76.15,12.15 v81,17 | v65,13 69.7,17.7 v81,17.7 88.7,17.7 97,26 100,26 103,29 103,38 114,49 v114,82
  pour Top: 71.9,18.6 71.5,18.2 71.5,14.75 72.75,13.5 80.5,13.5 82,15 82,17 80.4,18.6
3V0  (via drill 0.15 pad 0.25)
  Top 0.254: U$23.4 v79.64,4.01 v79.65,4 | v83,16.55 83,21.55 82.03,22.52 C93.2 | v114.6,82 114.6,85.4 113,87 107,87 106,86 106,83.12 J6.5
  Top 0.406: C93.2 79.49,22.52 | C92.2 76.99,22.54 C83.2 72.6,22.54 U$20.2
  Top 0.61: 79.49,22.52 C92.2 | C84.2 76.99,22.54
  Route2 0.254: v79.65,4 79.65,10.65 83,14 v83,16.55 83.45,17 88.9,17 97.3,25.4 100.2,25.4 103.55,28.75 103.55,37.8 114.5,48.75 114.5,81.9 v114.6,82
  pour Top: 73,25 72,24 71.45,23.45 71.45,23.4 71.45,19.55 72,19 82,19 83,19 84,20 84,23 83,24 82,25
3V3  (via drill 0.15 pad 0.25)
  Top 0.152: U$1.G9 v62,45 | U$1.K9 v62,41 | U$1.H10 v63,44 | U$1.J10 v63,42 | U$1.N5 v57,38 | U$1.E13 v66,47 | C26.2 78.55,36.95 v77,36.95 | 78.61,34.45 C25.2 77.02,34.47 v77,34.45 | C24.2 78.56,31.95 v77,31.95 | U$1.M13 v66,39 | U$1.N12 v65,38 | v77,42 C81.2 | v82.45,46.95 84.01,46.95 C48.2 | v87.95,46.95 87.97,46.97 C47.2 | v82.7,44.55 C21.2 | v77,44.5 C22.2 | v55,32 55,30 C82.2 | U$1.K8 v61,41 | v67.5,32 C23.2 | U$1.G8 v60,45 | C42.2 60,55.95 v60,54 58,52 v50,52 | U$1.D12 v64,47 | U5.9 v38,41.55 | U5.3 v42.8,41.55 | U5.1 v44.4,41.55 | v23,45 21.39,45 C13.2 | v23,42.5 21.39,42.5 C14.2 | v23,41 21.95,39.95 C43.2 | U5.14 v34,39.45 | v23,37.5 21.4,37.5 C44.2 | U5.27 23.6,35.55 22.9,34.85 21.45,34.85 C45.2 21.4,34.9 v21.4,33.7 | U1.56 v29.19,65.16 v29.2,65.15 | U1.42 32.73,69.27 v32.75,69.25 | U1.31 v37.76,68.16 v37.75,68.15 | U1.20 v37.76,62.66 v37.75,62.65 | v34,72.5 34.15,72.5 v34.4,72.75 34.72,73.07 v34.75,73.07 35.4,73.07 | 45.1,74.1 42.21,74.1 41.18,73.07 38,73.07 | 35.4,73.07 36,73.07 | 36,73.07 37,73.07 | 37,73.07 38,73.07 | U1.50 v29.25,68.16 | U1.4 31.23,60.48 v31.25,60.49 | v35.3,72.35 35.3,72.97 35.4,73.07 | U1.9 33.73,60.48 v33.75,60.5 | v35.8,72.35 36,72.55 36,73.07 | v36.95,72.35 36.95,73.02 37,73.07 | v37.45,72.35 37.45,72.52 38,73.07 | R33.1 45.07,25 v46.25,25 | R34.1 50.07,25 v51.25,25 | U5.43 35.6,31.11 v35.2,31.5 | v21.4,31.2 21.4,30 C67.2 | U5.49 40.4,31.2 v40.2,31.4 | C63.1 23.82,24.93 v23.75,25 | R30.1 28.84,24.96 v28.8,25 | R31.1 34.99,25 v33.8,25 | R32.1 39.99,25 v38.8,25 | R101.1 76.9,72 v77.9,72 | IC1.14 76.13,69.21 76.36,69.44 v76.75,69.44 | IC1.7 v80.49,67.39 v80.5,67.4 | IC1.30 77.63,62.58 v77.6,62.55 | R98.1 85.27,68.27 v86,69 | R2.1 36,52.29 v36,51
  Top 0.152: v48,52 43,52 v42,51 | R35.2 22.48,21.48 v22,21 | R16.2 61.71,76 v61,76
  Top 0.203: 61.07,8.87 R59.1
  Top 0.254: U$16.3 23.91,49.55 R89.1 | R100.1 106.45,67 | J3.12 109.62,67 106.45,67 | 46.4,78.45 48,80.05 v48,81 | 106.45,67 v105.6,67 | v29,7 29.34,6.66 J2.4
  Top 0.305: Q1.2 53,8.4 v53,8 | U2.8 48,6.17 v48,6 | C91.2 65.27,17.27 v65,17 | R142.1 97.07,4.07 v96,3 | 48.98,79.03 49,79
  Top 0.406: 46.4,78.45 45.92,78.92 45.26,79.59 LED1.A | C20.2 46.3,72.9 45.1,74.1 FB1.2 44.3,75 | U$25.2 89.82,42.18 v88,44 | v85,86 83.68,86 LED7.A
  Top 0.508: 45.92,78.92 45.92,80.83 46.02,80.92 46.02,82.02 v47,83 | v25,50 25,49.01 R89.1
  Top 0.813: LED1.A 46.42,81 v47,81
  Route2 0.152: v62,45 62.5,45.5 81.75,45.5 v82.7,44.55 84.45,44.55 86,43 78.5,43 v77,44.5 63.5,44.5 v63,44 | v62,41 62.5,40.5 71.95,40.5 75.5,36.95 v77,36.95 83.95,36.95 84,37 | v63,42 64.5,43.5 75.5,43.5 v77,42 78,41 84,41 85,40 | v57,38 57,35 55,33 v55,32 54,31 46,31 | v61,41 67.5,34.5 67.5,33 | 67.5,33 v67.5,32 | v65,38 71.05,31.95 v77,31.95 80.95,31.95 82,33 82,32.57 81.59,32.17 81.59,31.59 81,31 71,31 70,32 68.5,32 67.5,33 | v60,45 59.5,45.5 59.5,53.5 v60,54 | v66,39 70.55,34.45 v77,34.45 81.45,34.45 82,35 | v66,47 68,47 68.5,46.5 82,46.5 v82.45,46.95 85.4,44 87,44 | v64,47 64.5,46.5 67.5,46.5 68,46 87,46 v87.95,46.95 90.9,44 91,44 | v44.4,41.55 40.95,45 v23,45 | v42.8,41.55 41.85,42.5 v23,42.5 | v38,41.55 37.55,42 24,42 v23,41 | v34,39.45 24.95,39.45 v23,37.5 | v32.75,69.25 34,70.5 v34,72.5 | v29.25,68.16 29.79,68.7 32.95,68.7 34.4,70.15 v34.4,72.75 | v29.2,65.15 30.15,65.15 34.75,69.75 v34.75,73.07 | v31.25,60.49 31.25,65.25 35.3,69.3 v35.3,72.35 | v33.75,60.5 33.75,66.95 35.8,69 v35.8,72.35 | v37.75,62.65 36.2,64.2 36.2,71 36.95,71.75 v36.95,72.35 | v37.75,68.15 36.6,69.3 36.6,70.85 37.45,71.7 v37.45,72.35 | v51.25,25 50.25,24 49,24 | v46.25,25 48,25 | v35.2,31.5 21.7,31.5 v21.4,31.2 | v40.2,31.4 39.6,32 24,32 22.3,33.7 v21.4,33.7 | v77.9,72 78,72 | v76.75,69.44 78.53,71.22 78.53,71.47 | v80.5,67.4 81.6,68.5 81.6,69 | v77.6,62.55 83,67.95 83,69 | v50,52 v48,52
  Route2 0.254: v48,81 51,84 59.08,84 U$13.10 | v105.6,67 105.35,67 104.35,68 99,68 97,66 94,66
  Route2 0.305: v53,8 53,14 57,18 | v48,6 48,14 52,18 52,21 | v65,17 61,17 | v96,3 90,3 89,2
  Route2 0.406: 51,22 51,21 50,20 46,20 41,25 v38.8,25 v33.8,25 v28.8,25 v23.75,25 23,25 22,24 v22,21 22,10 25,7 v29,7 | J6.7 100.58,86 v85,86
  Route2 0.508: v47,83 45,85 19,85 16,82 16,65 18,63 18,56 24,50 v25,50 | 82,33 82,35 84,37 85,38 85,40 85,42 86,43 87,44 v88,44 91,44 94,47 94,66 91,69 v86,69 83,69 81.6,69 81,69 78.53,71.47 78,72 74,76 v61,76 v48,76
  Route2 0.813: v47,81 44,84 20,84 17,81 17,66 19,64 19,57 25,51 v36,51 v42,51 46,47 46,31 46,27 48,25 49,24 51,22 52,21 55,18 57,18 60,18 61,17 64,14 64,5 67,2 89,2
  pour Top: 32.6,72 33.4,72.8 33.4,75.35 33.65,75.6 43.1,75.6 44.45,76.95 44.45,86.15 45.35,87.05 48,87.05 49,86.05 49,74 47,72
  pour Top: 44.5,81.5 47,84 63,84 65,86 86,86 87,85 87,82 85,80 51,80 49,78 45,78 44.5,78.5
  pour Top: 65,86 66,87 85,87 86,86 86,85 65,85
  pour Top: 20.9,28.8 20.65,29.05 20.65,45.95 21.35,46.65 22.55,46.65 23.1,47.2 23.1,49.3 22.5,49.9 22.5,51 23,51.5 24.5,51.5 26,50 26,47 22,43 22,29.05 21.75,28.8
  pour Top: 64,22 66,24 70,24 71,23 71,14 70,13 68,13 67.55,12.55 67.55,11.05 67.3,10.8 66.3,10.8 66,11.1 66,14 64,16
  pour Top: 66,24 68,26 70,26 71,25 71,21 70,20 65,20 65,23
  pour Top: 43,1 49,1 50,2 50,7 49,8 45,8 42,5 42,2
  pour Top: 51,7 53,5 60,5 62,7 62,13 61,14 60,14 52,14 51,13
  pour Top: 89,4 91,2 112,2 114,4 114,6 113,7 112,7 111,8 94,8 90,8 89,7
B16_MODE1
  Top 0.152: 71,55.58 R14.2 71.5,56.04 71.5,52.5 U$1.B16
BTN1  (via drill 0.15 pad 0.25)
  Top 0.152: U$1.T10 62.5,32.7 63,32.2 63,31.65 63.3,31.35 65.8,31.35 66.25,30.9 66.25,25.1 65.15,24 v26.3,24 | v21.25,24 20,25.25 20,26.2 20.4,26.6 20.4,47.6 | U$7.2 18.39,49.6 20.4,47.6 | R89.2 20.72,47.92 20.4,47.6
  Top 0.254: C76.2 22.03,52.59 U$16.2 21.95,47.98 R89.2
  Top 0.305: S1.1 15.38,47.91 R25.1 | R25.1 17.07,49.6 U$7.2 | C58.2 R25.1
  Bottom 0.152: v26.3,24 v21.25,24
BTN2  (via drill 0.15 pad 0.25)
  Top 0.152: U$1.G3 v55,44 | 17.93,38.6 U$8.2 18,38.53 v18,37
  Top 0.305: S2.1 15.48,36.91 R26.1 | R26.1 C59.2 | R26.1 17.21,38.65 U$8.2
  Bottom 0.152: v55,44 47.85,44 38.7,34.85 20.15,34.85 v18,37
BTN3  (via drill 0.15 pad 0.25)
  Top 0.152: U$1.G4 v56,44 | v19,27.65 18.98,27.64 U$9.2
  Top 0.305: S3.1 15.48,25.91 R27.1 | R27.1 17.2,27.64 U$9.2 | C60.2 R27.1
  Bottom 0.152: v56,44 55.5,43.5 48.05,43.5 32.2,27.65 v19,27.65
BTN4  (via drill 0.15 pad 0.25)
  Top 0.152: U$1.H4 v56,43 | v19,16.65 18.98,16.62 U$10.2
  Top 0.305: S4.1 10.96,15.76 R28.1 | R28.1 17.09,16.62 U$10.2 | C61.2 R28.1
  Bottom 0.152: v56,43 48.25,43 21.9,16.65 v19,16.65
BTN5  (via drill 0.15 pad 0.25)
  Top 0.152: U$1.H3 55,43 48.25,43 43.7,38.45 28.45,38.45 22.75,32.75 22.75,27.6 v20.55,25.4 | v20.55,24 20.55,7.2 18.95,5.6 17.91,5.6 U$11.2
  Top 0.305: S5.1 10.94,4.71 R29.1 | C62.2 R29.1 | R29.1 17.14,5.62 U$11.2
  Bottom 0.152: v20.55,25.4 v20.55,24
C15_MODE2
  Top 0.152: U$1.C15 68,49 69,49 74,54 74,56.04 R15.2
CKXTAL1
  Top 0.152: U$17.3 78.56,49.9 C78.2 78.13,53.55 IC1.31
CKXTAL2
  Top 0.152: U$17.1 81.37,51.94 C77.2 82.51,52.95 79.3,52.95 78.63,53.62 IC1.32
DIP1
  Top 0.152: U$1.B10 63,50 63,60.5 58.95,64.55 58.95,68.72 R42.2
  Top 0.254: R37.1 R16.1
  Top 0.406: R37.1 R42.2
DIP2
  Top 0.152: U$1.A10 62.5,60.3 56.35,66.45 56.35,68.85 57.49,69.99 R43.2 58.01,69.99
  Top 0.406: R38.1 R43.2
DIP3
  Top 0.152: U$1.B9 62,50 62,60.02 55.16,66.86 54.29,66.86 53.85,67.3 53.85,68.75 R44.2 55.4,70
  Top 0.406: R39.1 R44.2
DIP4
  Top 0.152: 52.76,69.99 R45.2 51.3,68.72 51.3,67.2 52.09,66.41 54.83,66.41 61.5,59.73 U$1.A9
  Top 0.406: R40.1 R45.2
DIP5
  Top 0.152: U$1.A8 61,51 61,59.35 54.35,66 49.5,66 48.7,66.8 48.7,68.77 R46.2 50.16,70.04
  Top 0.406: R41.1 R46.2
DVP_!PWDN!  (via drill 0.15 pad 0.25)
  Top 0.152: v77.66,5 77.64,5.02 U$23.8 77.65,8.25 76.9,9 74.4,9 73.38,10.02 R120.1 | U$1.J15 68,42 v72,42
  Bottom 0.152: v77.66,5 77.66,39.84 76,41.5 73.55,41.5 73.05,42 v72,42
DVP_!RST!  (via drill 0.15 pad 0.25)
  Top 0.152: U$23.6 78.64,8.41 78.05,9 77.65,9 76.63,10.02 R119.1 73.95,11.44 73.95,12.65 73.3,13.3 72.2,13.3 v71.75,13.75 | U$1.L14 v67,40
  Bottom 0.152: v67,40 71,40 71.75,39.25 v71.75,13.75
DVP_D0  (via drill 0.15 pad 0.25)
  Top 0.152: U$23.19 72.14,5.42 v71.74,5.01 | U$1.N16 70.5,38.5 v71.15,37.85
  Bottom 0.152: v71.74,5.01 71.74,12.66 71.3,13.1 71.3,37.7 v71.15,37.85
DVP_D1  (via drill 0.15 pad 0.25)
  Top 0.152: U$23.21 71.14,5.57 v70.59,5.01 | U$1.M14 v67,39
  Bottom 0.152: v67,39 69,39 69.95,38.05 70.05,37.95 70.05,12.9 70.59,12.36 v70.59,5.01
DVP_D2  (via drill 0.15 pad 0.25)
  Top 0.152: U$23.22 70.64,5.64 v70,5 | U$1.N15 68,38 v69,38
  Bottom 0.152: v70,5 70,12.3 69.55,12.75 69.55,37.45 v69,38
DVP_D3  (via drill 0.15 pad 0.25)
  Top 0.152: U$23.20 71.64,5.49 v71.15,5 | U$1.M15 68,39 v70,39
  Bottom 0.152: v70,39 70.59,38.41 70.59,13.01 71.14,12.46 v71.14,5 v71.15,5
DVP_D4  (via drill 0.15 pad 0.25)
  Top 0.152: U$23.18 72.64,5.34 v72.3,5 | U$1.L15 68,40 71.3,40 v72.3,39
  Bottom 0.152: v72.3,5 v72.3,39
DVP_D5  (via drill 0.15 pad 0.25)
  Top 0.152: U$23.16 73.64,5.17 v73.49,5.01 | U$1.K14 v67,41
  Bottom 0.152: v73.49,5.01 73.49,40.51 73,41 v67,41
DVP_D6  (via drill 0.15 pad 0.25)
  Top 0.152: U$23.14 v74.64,5.01 v74.65,5 | v74.6,39.4 73,41 68,41 U$1.K15
  Bottom 0.152: v74.6,39.4 74.6,5.05 v74.65,5
DVP_D7  (via drill 0.15 pad 0.25)
  Top 0.152: U$23.12 v75.64,5.01 v75.65,5 | v67,42 U$1.J14
  Bottom 0.152: v75.65,5 75.65,40.35 75,41 73.5,41 73,41.5 71.9,41.5 71.4,42 v67,42
DVP_HSYNC  (via drill 0.15 pad 0.25)
  Top 0.152: U$23.9 v77.14,5.01 v77.15,5 | v76.45,39.91 74.86,41.5 U$1.K16
  Bottom 0.152: v77.15,5 77.15,31.15 76.45,31.85 v76.45,39.91
DVP_PCLK  (via drill 0.15 pad 0.25)
  Top 0.152: U$23.17 73.14,5.24 v72.9,5 | U$1.L16 71.38,40.5 v72.89,38.99
  Bottom 0.152: v72.9,5 72.9,38.98 v72.89,38.99
DVP_SBCL
  Top 0.152: U$24.P$1 79.39,11.04 R122.1 78.37,9.18 79.14,8.41 U$23.5
DVP_SBDA
  Top 0.152: U$23.3 80.14,8.39 81.37,9.62 R123.1 82.84,8.55 84.4,8.55 85.36,9.51 U$24.P$4
DVP_VSYNC  (via drill 0.15 pad 0.25)
  Top 0.152: U$23.7 78.14,5.02 v78.16,5 | v74,42 73,42 72.5,42.5 U$1.J16
  Bottom 0.152: v78.16,5 78.16,39.84 76,42 v74,42
DVP_XCLK  (via drill 0.15 pad 0.25)
  Top 0.152: U$1.G12 64,44 v64,41 | v68,9.7 U4.4
  Bottom 0.152: v64,41 64.5,40.5 64.5,39.5 64,39 64,38 67,35 68,35 68.55,34.45 68.55,13.55 67,12 67,10.7 v68,9.7
DVP_XCLK_2V8
  Top 0.152: U$23.13 75.14,7.92 74.36,8.7 68.16,8.7 67.65,9.2 65.26,9.2 U4.3
GND  (via drill 0.15 pad 0.25)
  Top 0.152: R57.1 40.92,2.82 40.74,3 v39,3 | 116,47.65 D4.2 116,47.7 116,52 113.83,54.17 J3.10 | U$23.2 80.64,5.36 81.27,4.73 U$23.25 | U$23.26 67.27,4.73 | 43.92,52.38 43.92,53 | 43.92,53 C57.2 44.97,53.03 v45,53 | 44.47,52.45 43.92,53 | 76.29,27.94 C64.1 76.42,26.03 v76.45,26 | U1.11 34.68,59.34 34.68,58.02 v34.7,58 | D2.2 11.07,62 v11.55,62 | D3.2 11.02,60 v11.55,60 | R10.1 15.46,61.54 v16,61 | U1.51 28.89,67.66 v29.25,67.3 | U1.47 30.23,69.27 v30.25,69.25 | U1.35 36.23,71.63 v36.25,71.65 | U1.25 v37.76,65.16 v37.75,65.15 | IC1.33 76,65.26 v76,65 | IC1.33 78,65.02 v78,65 | IC1.33 76.02,67 v76,67 | IC1.33 77.74,67 v78,67 | U$1.R2 v54,36 | U$1.P3 v55,37 | U$1.N4 v56,38 | U$1.M5 v57,39 | U$1.L6 v58,40 | U$1.J8 v60,42 | U$1.H8 v60,44 | U$1.H9 v62,44 | v61,43 U$1.J9 | U$1.F6 v58,46 | U$1.E5 v58,47 | U$1.B2 v54,50 | U$1.C3 v55,49 | U$1.D4 v56,48 | U$1.F11 v64,46 | U$1.E12 v65,47 | U$1.D13 v66,48 | U$1.C14 v67,49 | U$1.B15 v68,50 | U$1.L11 v64,40 | U$1.M12 v65,39 | U$1.N13 v66,38 | U$1.P14 v67,37 | U$1.R15 v68,36 | R121.2 68.45,11 v68,11 | R120.2 74,10.29 v74,10 | R119.2 75.83,11.92 v76.75,11 | U2.4 42.35,14.65 v42,15 | U$14.10 52.72,4 v54,4 | U$14.9 60.46,4 v59,4 | U$14.2 v55.34,5.51 v55.35,5.5 | U$27.17 108.8,25.2 v109,25 | U$27.11 108.8,28.2 v109,28 | U$27.8 108.91,29.7 v109,29.61 | U$27.5 108.95,31.2 v109,31.25 | U$27.2 105.09,32.7 v105,32.8 | C49.2 74,71.56 v74,70 | R99.1 91.89,74 v93,74 | C80.1 94.48,68.48 v95,69 | C46.2 84.97,64.03 v85,64 | R97.1 84.41,62 v85,62 | R14.1 71.48,59.48 v71.5,59.5 | R15.1 73.98,59.48 v74,59.5 | R103.2 80,56.06 v80,54 | C50.1 82.47,54.03 v82.5,54 | U$17.2 78.83,52.62 v78.45,53 | C78.1 77,49.56 v77,48 | U$17.4 81.08,48.77 v81.1,48.75 | C77.1 83.52,48.78 v83.55,48.75
  Top 0.152: C38.1 80,47.5 v80,48.15 | C48.1 85.93,48.08 v86,48.15 | C47.1 91.46,47.69 v91,48.15 | C22.1 81.44,44.49 v81.96,43.96 | C81.1 v81.99,42 v82,41.99 | C39.1 80.84,39.51 v82,38.35 | C26.1 80.86,37.35 v82,37.35 | C25.1 82,33 v82,32 | C24.1 81.55,31 v82,31 | C68.1 82,26.6 v82,26 | R13.1 79,27.06 v79,26 | R_EXTR.2 v55.01,22.01 v55,22 | C37.1 v50,59 | C28.1 52,58.41 v52,59 | C29.1 54.98,58.98 v55,59 | C41.1 57,58.45 v57,59 | C42.1 59.9,58.9 v60,59 | R1.1 44.38,55 v45,55 | C10.1 44.37,70 v45,70 | C9.1 44.97,67.97 v45,68 | C20.1 v47,70 | C15.1 27,52.07 v27,50 | R3.1 38.72,50.72 v38,50 | C21.1 86.41,45 v87,45 | R102.1 103.98,47.02 v105,46 | C32.1 58,27.58 v58,24.45 | C23.1 v67.49,26.56 v67.5,26.55 | R11.1 15.41,57.04 v15.45,57 | U1.5 31.73,58.02 v31.75,58 | U1.15 36.73,58.02 v36.75,58 | U1.1 29.73,58.02 v29.75,58 | U1.10 34.23,58.03 v34.2,58 | U1.13 35.73,58.02 v35.75,58 | C76.1 26.56,58 v27,58 | C31.1 48.45,29 v48.75,29 | C35.1 50.95,29 v51.25,29 51.54,29 | C27.1 51.54,29 | C82.1 54.93,28.07 54,29 51.54,29 | J2.13 24.03,15 v25,15 | J2.12 24.98,9.62 v25,9.6 | J2.6 27,5.18 v27,6.2 | J2.11 24.62,3.53 v25,3.53 | J2.16 36.11,4 v36,4 | J2.15 37.37,11 v37,11 | J2.14 v37,16.01 v37,16 | U$2.4 30,51.9 v30,50 | U$15.2 74.2,29.2 v74,29
  Top 0.203: U$14.2 55.34,6.29
  Top 0.254: C76.1 23.93,52.59 U$16.1 | S5.4 4.38,6.62 v5,6 | S4.4 4.37,17.64 v5,17 | S3.4 4.34,28.66 v5,28 | S2.4 4.38,39.62 v5,39 | S1.4 4.36,50.65 v5,50 | C65.2 48.42,5.42 v49,6 | U5.12 v35.6,39.45 | U5.6 v40.4,39.45 | U5.41 v34,31 | U5.46 v38,31 | U5.52 v42.8,31 | U5.54 v44.4,31 | U5.28 v23.6,31 | U$23.26 67.74,6.26 v67,7 | U$23.25 83.04,6.04 v84,7 | U$23.15 74.14,4.14 v74,4 | U4.2 63.36,10.36 v63,10 | C85.1 68,20.59 v68,19 | C91.1 67.97,14.03 v68,14 | D7.3-8 101,27 v100,28 | D6.3-8 101.5,30.5 v101,31 | C96.1 97.51,41 v99,41 | C95.1 102.44,41 v104,41 | R46.1 50,68.11 v50,67 | R45.1 52.57,67.02 v52.55,67 | R44.1 55.75,67.45 v55.75,67 | R43.1 57.67,67.02 v57.65,67 | R42.1 60.22,67.27 v59.95,67 | D1.3-8 48.33,56.43 v48.35,56.45 | C53.1 65,58.99 65,57 | 65,57 65,56 66,55 | v70,54 69,53 68,53 66,55 | C52.1 66.53,58.53 65,57 | C51.1 67.03,56.03 66,55 | C54.1 59.98,25.58 | v60,24.45 59.98,24.46 59.98,25.58 | C56.1 61.2,26.8 | 61.2,26.8 59.98,25.58 | C55.1 63.7,26.8 61.2,26.8 | C79.1 105.53,72.47 v106,72 | D5.2 116,69.55 116,70 v115,71
  Top 0.305: C59.1 17.89,40.32 U$8.1 | U$7.1 17.89,51.27 C58.1 | S2.4 5.45,41.98 C59.1 | S1.4 5.42,52.98 C58.1 | S3.4 5.42,30.98 C60.1 16.25,31 v18,31 | S4.4 5.43,19.98 C61.1 16.25,20 v18,20 | S5.4 5.5,9.03 C62.1 17.97,9.03 v18,9 | U$6.2 v11.49,57.59 v11.5,57.6 | J1.B1-A12 8.43,57.45 J1.2 | J1.A1-B12 8.43,64.55 J1.1 | C58.1 17.98,52.98 v18,53 | C59.1 16.25,42 v18,42 | C13.1 18.41,46 v18,46 | C14.1 18.91,43 v18,43 | C43.1 18.4,41 v18,41 | C44.1 v18,36 | C45.1 18.5,34 v18,34 | C66.1 18.9,33 v18,33 | C67.1 19.4,30 v18,30 | U$9.1 17.89,28.89 v18,29 | U$10.1 17.89,17.89 v18,18 | U$11.1 17.89,6.89 v18,7 | v74,19 74.47,19.47 C83.1 73.95,21.16 U$20.1 | C84.1 76.97,19.47 v76.5,19 | C92.1 79.47,19.47 v79,19 | C93.1 81.97,19.47 v81.5,19 | v74,14 74.47,14.47 C89.1 73.95,15.91 U$22.1 | C90.1 76.97,14.47 v76.5,14 | C94.1 79.47,14.47 v79,14 | C98.1 97.48,17.48 v98,18 | C97.1 102.41,17.41 v103,18 | C99.1 95,19.55 v95,19 | R134.2 100,19.55 v100,19
  Top 0.406: C4.1 4,75.02 v4,73.55 | C5.1 6.45,75.01 v6.45,73.55 | C6.1 8.97,73.58 v9,73.55 | C30.1 3.97,68.58 v4,68.55 | C34.1 6.52,68.57 v6.5,68.55 | C33.1 9,70.07 v9,68.55 | R156.2 12.03,83.02 v12.05,83 | R157.2 28,84.49 v28,83 | R12.2 v44.01,82.96 v44,82.95 | R5.2 39.08,81.92 v40,81 | U$3.2 41.88,78.32 v41.9,78.3 | R9.2 23.06,81.94 v24,81 | U$5.2 v25.86,78.31 v25.85,78.3 | U$4.2 9.87,78.38 v9.9,78.35 | R7.2 7.08,81.92 v8,81 | C17.1 20.02,73.53 v20.05,73.5 | C18.1 v22.49,73.51 v22.5,73.5 | C19.1 24.97,73.53 v25,73.5 | C40.1 v20,68.5 | C36.1 v22.5,68.5 | C1.1 36.02,73.53 v36.05,73.5 | C2.1 v38.49,73.51 v38.5,73.5 | C3.1 41,75.01 v41,73.5 | C11.1 18.94,65 v21,65 | C12.1 20.98,62.47 v21,62.45 | C7.1 20.98,58.52 v21,58.5 | C8.1 20.07,56.07 v21,57 | v94,74 91.89,74
  Top 0.508: C5.1 | C18.1 | C2.1 | U$23.25 82.77,5 | 68.01,5 U$23.26 | 24.96,74.91 C19.1 | J1.3 3,64.87 v3,64 | J1.1 7.32,65.32 v6,64 | J1.4 3,57.13 v3,58 | J1.2 7.32,56.68 v6,58
  Top 0.61: 76.95,20.64 C84.1 | 79.45,20.62 C92.1 | 81.95,20.64 C93.1
  Top 1.016: C6.1 | C19.1
  Route15 0.152: v59,4 v54,4 55.35,5.35 v55.35,5.5 | v60,59 v50,59 | v81.96,43.96 81.96,47.89 v81.1,48.75 | v82,41.99 81.9,42.09 81.83,42.09 80,43.93 v80,48.15 | v82,38.35 v82,37.35 | v36.75,58 36,58 | 36,58 v35.75,58 v34.7,58 v34.2,58 v31.75,58 v29.75,58 v27,58 | v29.25,67.3 28,68.55 28,73 | v30.25,69.25 29,70.5 29,73 | v36.25,71.65 36.25,73.3 v36.05,73.5 | v37.75,65.15 36.25,63.65 36.25,58.25 36,58 | v54,50 53.5,50.5 50,50.5 | v55,49 U$1.B2 50,49.5 | v56,48 U$1.C3 50,48.5 | v58,47 U$1.E5 50,46.5 | v58,46 57.5,45.5 50,45.5 | v60,44 59.5,44.5 50,44.5 | v60,42 59.5,42.5 50,42.5 | v58,40 57.5,40.5 50,40.5 | v57,39 56.5,39.5 50,39.5 | v56,38 55.5,38.5 50,38.5 | v55,37 54.5,37.5 50,37.5 | v54,36 53.5,36.5 50,36.5 | v68,50 72,50 | v67,49 72,49 | v66,48 72,48 | v65,47 U$1.D13 72,47.5 | v64,46 U$1.E12 72,46.5 | v62,44 62.5,44.5 72,44.5 | v61,43 U$1.H9 72,43.5 | v64,40 64.5,40.5 72,40.5 | v65,39 65.5,39.5 72,39.5 | v66,38 66.5,38.5 72,38.5 | v67,37 72,37 | v68,36 72,36 | v51.25,29 v48.75,29
  Route15 0.254: v49,6 50,6 52,4 v54,4 | v23.6,31 28,31 | 28,31 v34,31 | v40.4,39.45 v35.6,39.45 31,34.85 31,34 | v38,31 35,34 | 35,34 31,34 | 31,34 28,31 | v42.8,31 39.8,34 | 39.8,34 35,34 | v44.4,31 41.4,34 39.8,34 | v50,67 v59.95,67 | v50,59 49,59 48.09,58.09 48.09,56.76 48.35,56.5 v48.35,56.45 46.9,55 v45,55
  Route15 0.305: v74,19 v81.5,19 | v74,14 v79,14
  Route15 0.508: v18,36 v18,30 v18,29 v18,7 18,5 20.05,2.95 | v18,41 v18,46 | 20.05,2.95 20.95,2.95 | v5,50 v5,6 8.05,2.95 20.05,2.95 | v4,73.55 v9,73.55 | v8,81 9.9,79.1 | 9.9,79.1 v9.9,78.35 9,77.45 v9,68.55 v4,68.55 3,67.55 v3,64 | 9.9,79.1 12.05,81.25 v12.05,83 | v20.05,73.5 v25,73.5 | v24,81 25.85,79.15 | 25.85,79.15 v25.85,78.3 25,77.45 v25,73.5 | 25.85,79.15 28,81.3 v28,83 | 25,73 v25,73.5 | 25,73 22.5,70.5 v22.5,68.5 v20,68.5 14.5,63 5,63 | v40,81 41.9,79.1 | 41.9,79.1 v41.9,78.3 41,77.4 v41,73.5 v36.05,73.5 35.55,74 34,74 33,73 29,73 28,73 25,73 | 41.9,79.1 44,81.2 v44,82.95
  Route15 0.813: v3,64 3,62 | 3,62 3,60 | 3,60 v3,58 | v6,64 5,63 4,62 3,62 | v6,58 4,60 3,60
  pour Route15: 6,88 2,84 2,4 5,1 114,1 117,4 117,85 114,88
H11_IOT27A_OSC_CLK  (via drill 0.15 pad 0.25)
  Top 0.152: U$1.H11 v63,43 | v69,31.5 70.02,30.48 R36.2
  Route2 0.152: v63,43 62,42 61,42 60.5,41.5 60.5,39.5 61.5,38.5 62.5,38.5 65.5,35.5 65.5,33.4 67.4,31.5 v69,31.5
H_CEC
  Top 0.152: Q3.2 106.66,7.28 R144.2 R138.2
HCEC  (via drill 0.2)
  Top 0.152: Q3.3 115.15,11.15 117,13 117,26 116,27 109.8,27 109.6,27.2 U$27.13 | Q3.3 106.86,10 109.2,10 R135.2 | U$28.1 109.58,18.42 v108,20 | Q3.3 104.56,10 v103,10
  Bottom 0.152: v108,20 107,19 107,16 106,15 106,13 v103,10
HDDC_SCL  (via drill 0.2)
  Top 0.152: Q4.3 103.13,11.13 104,12 115,12 116.5,13.5 116.5,25.2 115.5,26.2 U$27.15 105.2,26.2 v105,26 | R136.2 111.88,15.87 U$28.6 109.58,16.05 109.08,16.54 109.08,17.71 108.8,18 | U$28.2 108.8,18 | v105,19 105.89,18.11 106.62,18.11 107.32,17.4 108.04,17.4 108.64,18 108.8,18
  Bottom 0.152: v105,26 v105,19
HDDC_SDA  (via drill 0.15, 0.2)
  Top 0.152: Q2.3 93.34,12.8 114.8,12.8 115.95,13.95 115.95,25.05 115.3,25.7 109.5,25.7 | 109.5,25.7 U$27.16 | U$28.4 107.68,15.68 v107,15 | v116,11 116.47,10.53 R137.2 | v110.65,21.8 110.65,24.55 109.5,25.7
  Bottom 0.152: v107,15 111,15 | 111,15 112,15 v116,11 | 111,15 110,16 110,19 110.65,19.65 v110.65,21.8
HDMI_3V3  (via drill 0.2)
  Top 0.152: R129.2 95.56,30 v94,30 | R130.2 95.21,27.1 v94,27.1 | R131.2 v94.03,24.97 | R128.2 94.49,32.52 v94,33
  Top 0.2: R127.2 102,38.49 102,38.95 | R126.2 100.52,38.43 100,38.95 | R125.2 98.02,37.93 97,38.95 | R124.2 95.52,38.48 95.05,38.95
  Top 0.508: U$25.1 93.43,43 93.55,43 | C95.2 98.48,43 93.55,43 | C96.2 94.28,42.27 | 94.28,42.27 93.55,43 | 94.28,42.27 94.28,40 | 94.28,40 94.28,39.73 95.05,38.95 97,38.95 100,38.95 102,38.95 | 94.28,40 93.28,39 v93,39